# EAGLE design pcb1_12V_XL (EAGLE 9.6.2)
Assembly variants: ECU Type I non terminated, b

## Sheet 1 of 11
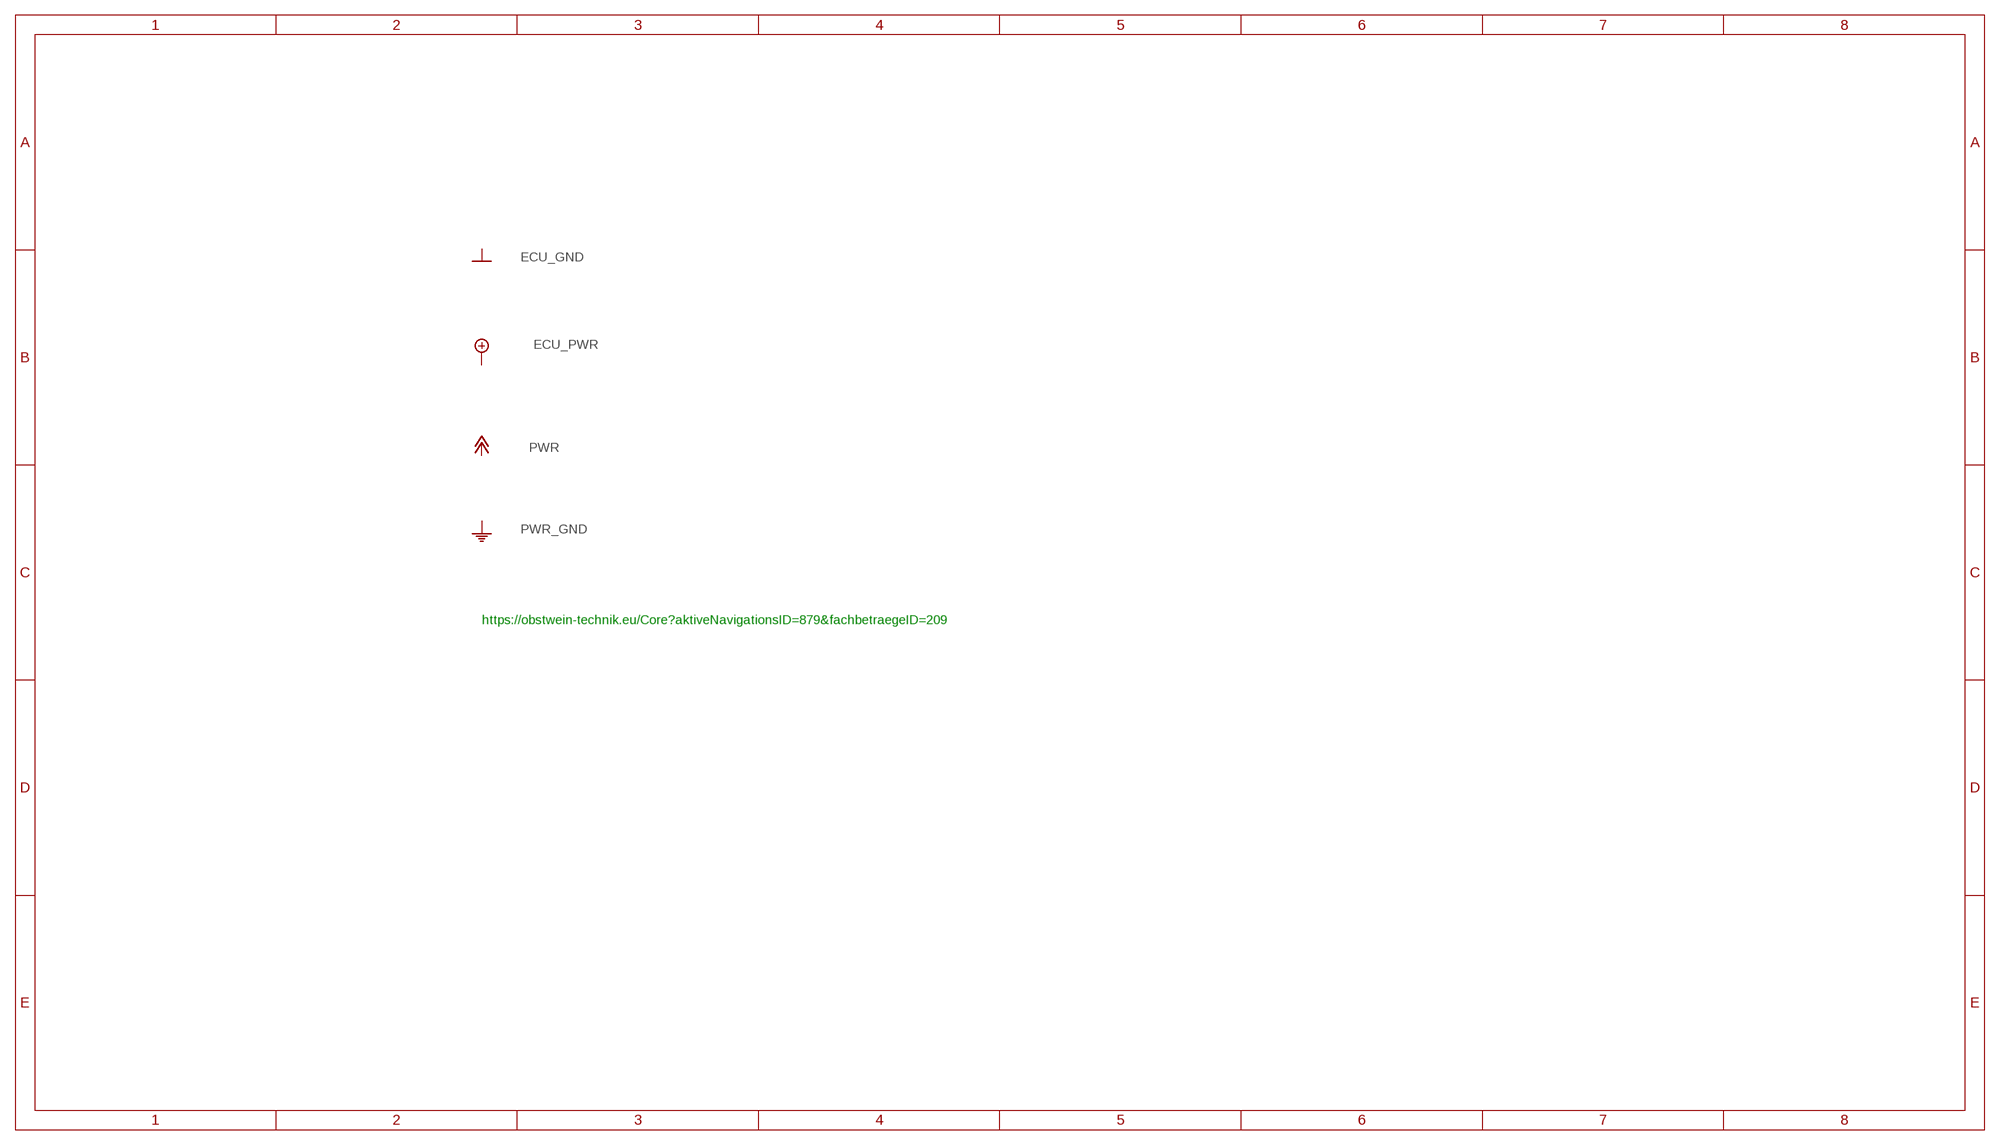
[diagram p0: schematic, sheet 1]

### Notes on the sheet
- https://obstwein-technik.eu/Core?aktiveNavigationsID=879&fachbetraegeID=209

## Sheet 2 of 11
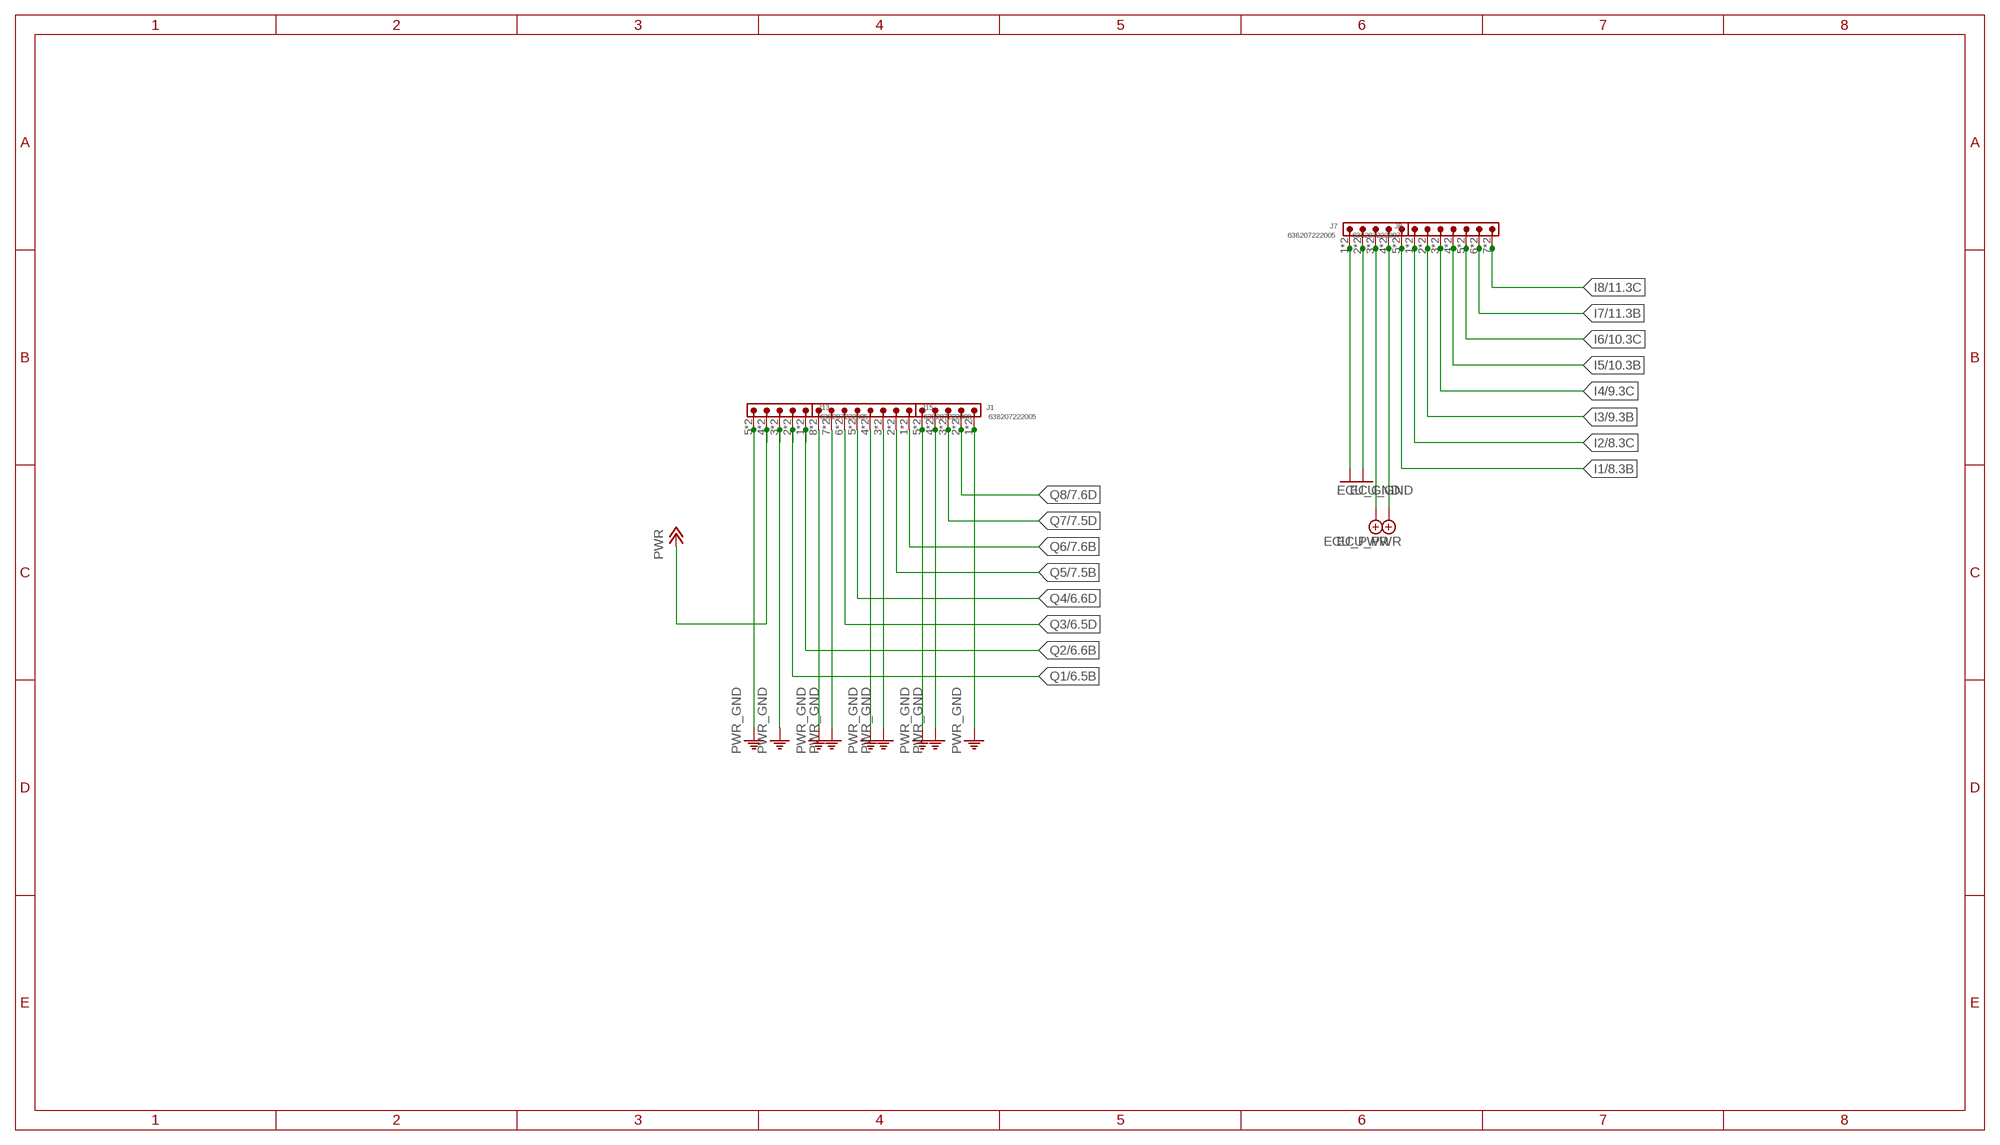
[diagram p1: schematic, sheet 2]

### Parts
J1  638207222005  638207222005  [638207222005]
J7  638207222005  638207222005  [638207222005]
J8  638207222007  638207222007  [638207222007]
J13  638207222005  638207222005  [638207222005]
J15  638207222008  638207222008  [638207222008]

### Nets
ECU_GND [GND]: J7.1 J7.A1 ; also sheet 3,4,5,6,7,8,9,10,11
ECU_PWR: J7.3 J7.A3 ; also sheet 3,6
I1: J7.5 J7.A5 ; also sheet 8
I2: J8.1 J8.A1 ; also sheet 8
I3: J8.2 J8.A2 ; also sheet 9
I4: J8.3 J8.A3 ; also sheet 9
I5: J8.4 J8.A4 ; also sheet 10
I6: J8.5 J8.A5 ; also sheet 10
I7: J8.6 J8.A6 ; also sheet 11
I8: J8.7 J8.A7 ; also sheet 11
N$7: J7.4 J7.A4 ; supply symbol labelled ECU_PWR
N$16 [GND]: J7.2 J7.A2 ; supply symbol labelled ECU_GND
N$20: J13.5 J13.A5 ; supply symbol labelled PWR_GND
PWR: J13.4 J13.A4 ; also sheet 6,7
PWR_GND: J1.1 J1.4 J1.5 J1.A1 J1.A4 J1.A5 J13.3 J13.A3 J15.3 J15.4 J15.7 J15.8 J15.A3 J15.A4 J15.A7 J15.A8 ; also sheet 6,7
Q1: J13.2 J13.A2 ; also sheet 6
Q2: J13.1 J13.A1 ; also sheet 6
Q3: J15.6 J15.A6 ; also sheet 6
Q4: J15.5 J15.A5 ; also sheet 6
Q5: J15.2 J15.A2 ; also sheet 7
Q6: J15.1 J15.A1 ; also sheet 7
Q7: J1.3 J1.A3 ; also sheet 7
Q8: J1.2 J1.A2 ; also sheet 7

## Sheet 3 of 11
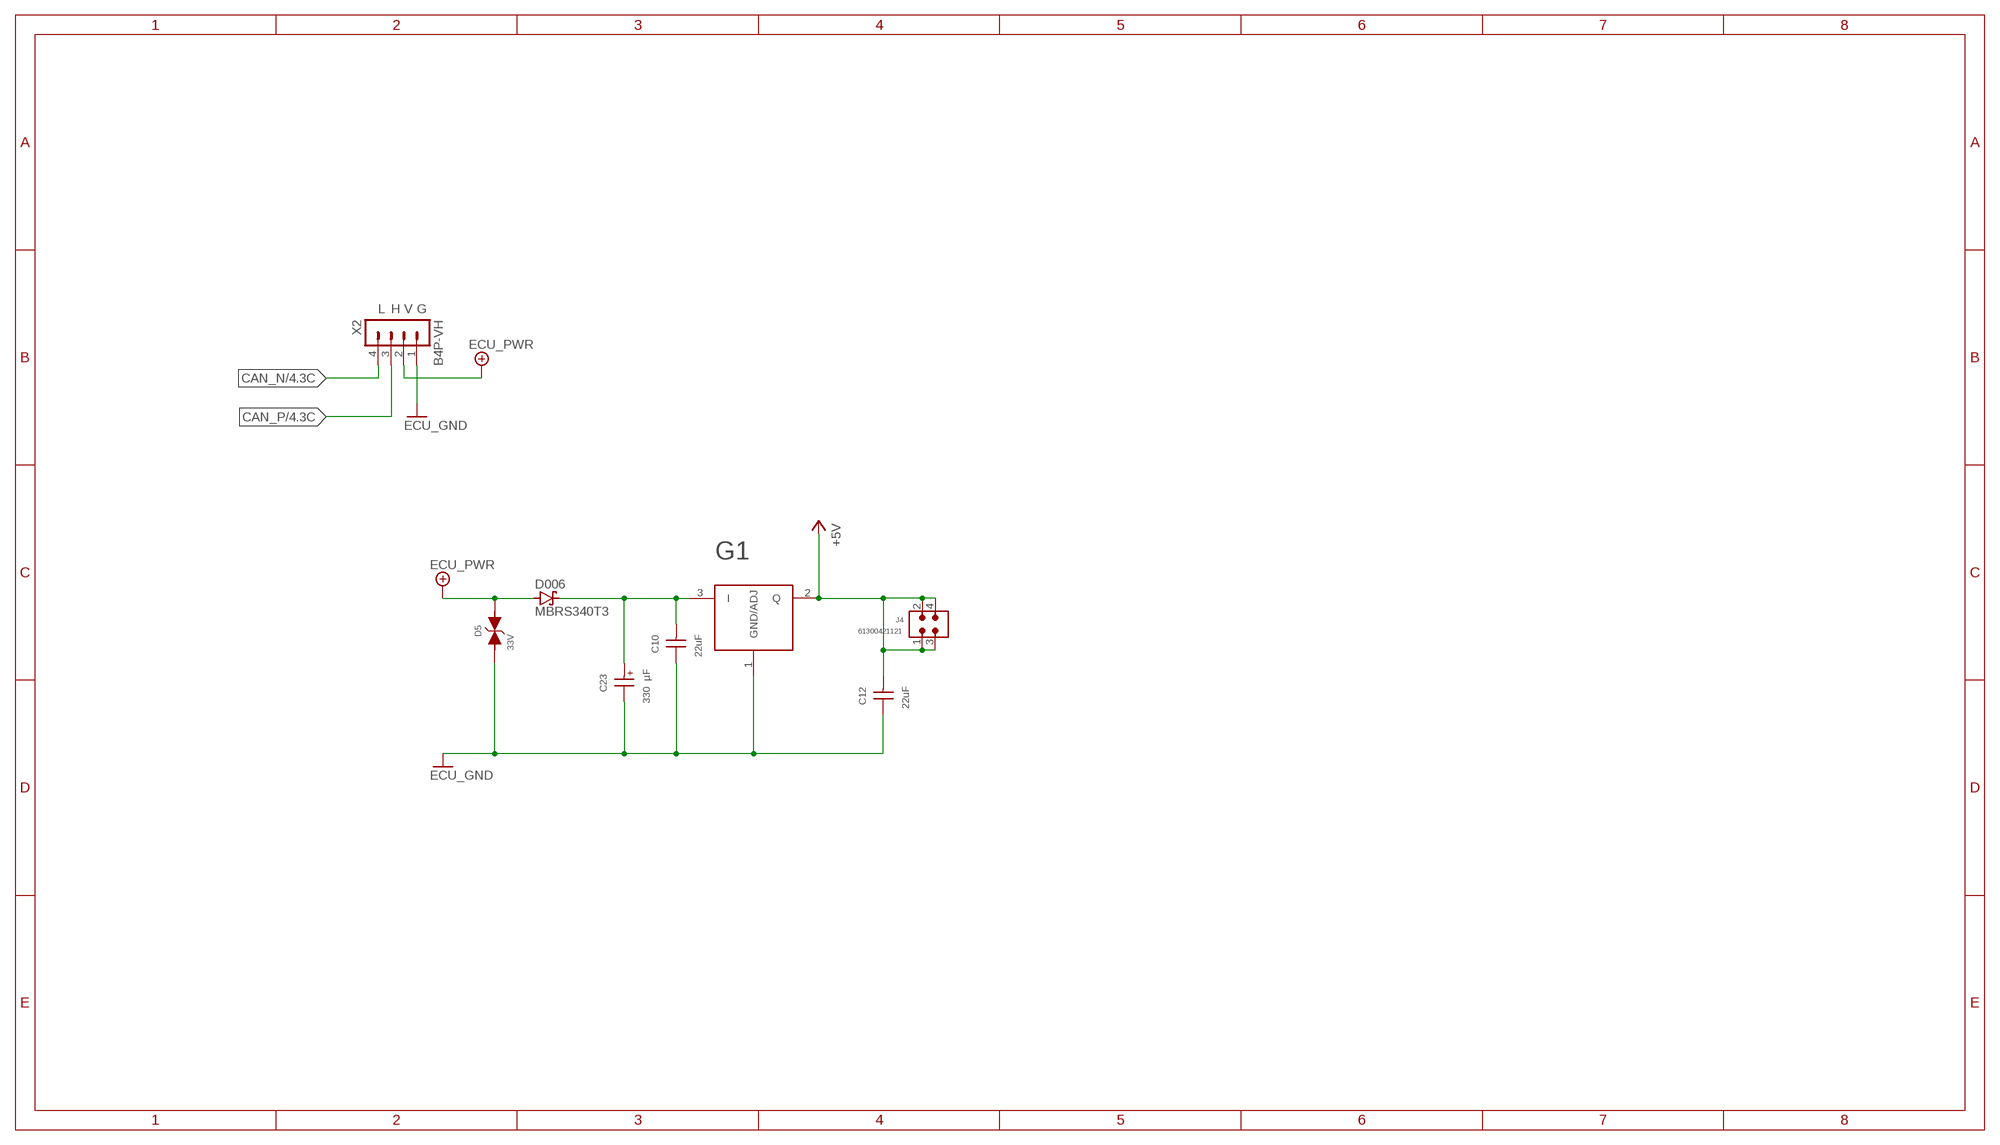
[diagram p2: schematic, sheet 3]

### Parts
C10  22uF  WCAP-CSGP_1210_H2.5_885012109014_25V(DC)  [WCAP-CSGP_1210_H2.5]
C12  22uF  WCAP-CSGP_0805_H1.25_885012107011_10V(DC)  [WCAP-CSGP_0805_H1.25_R]
C23  330 µF  WCAP-ASLI_12.5X14_865080662019  [WCAP-ASLI_12.5X14(DXL)]
D5  33V  WE-TVSP_DO-214AB_3000W_BI_824551331  [WE-TVSP_DO-214AB_BIDIRECTIONAL]
D006  MBRS340T3  [SMC]
G1  IFX27001TF_V50  [INF-PG-TO252-3-11_N]
J4  61300421121  6130XX21121_61300421121  [61300421121]
X2  B4P-VH  [B4P-VH]

### Nets
+5V: C12.2 G1.2(Q) J4.1 J4.2 J4.3 J4.4 ; also sheet 4,5
CAN_N: X2.4 ; also sheet 4
CAN_P: X2.3 ; also sheet 4
ECU_GND [GND]: C10.1 C12.1 C23.2(-) D5.1 G1.1(GND/ADJ) X2.1 ; also sheet 2,4,5,6,7,8,9,10,11
ECU_PWR: D5.2 D006.A X2.2 ; also sheet 2,6
N$3: C10.2 C23.1(+) D006.C G1.3(I)

### Notes on the sheet
- L | H | V | G

## Sheet 4 of 11
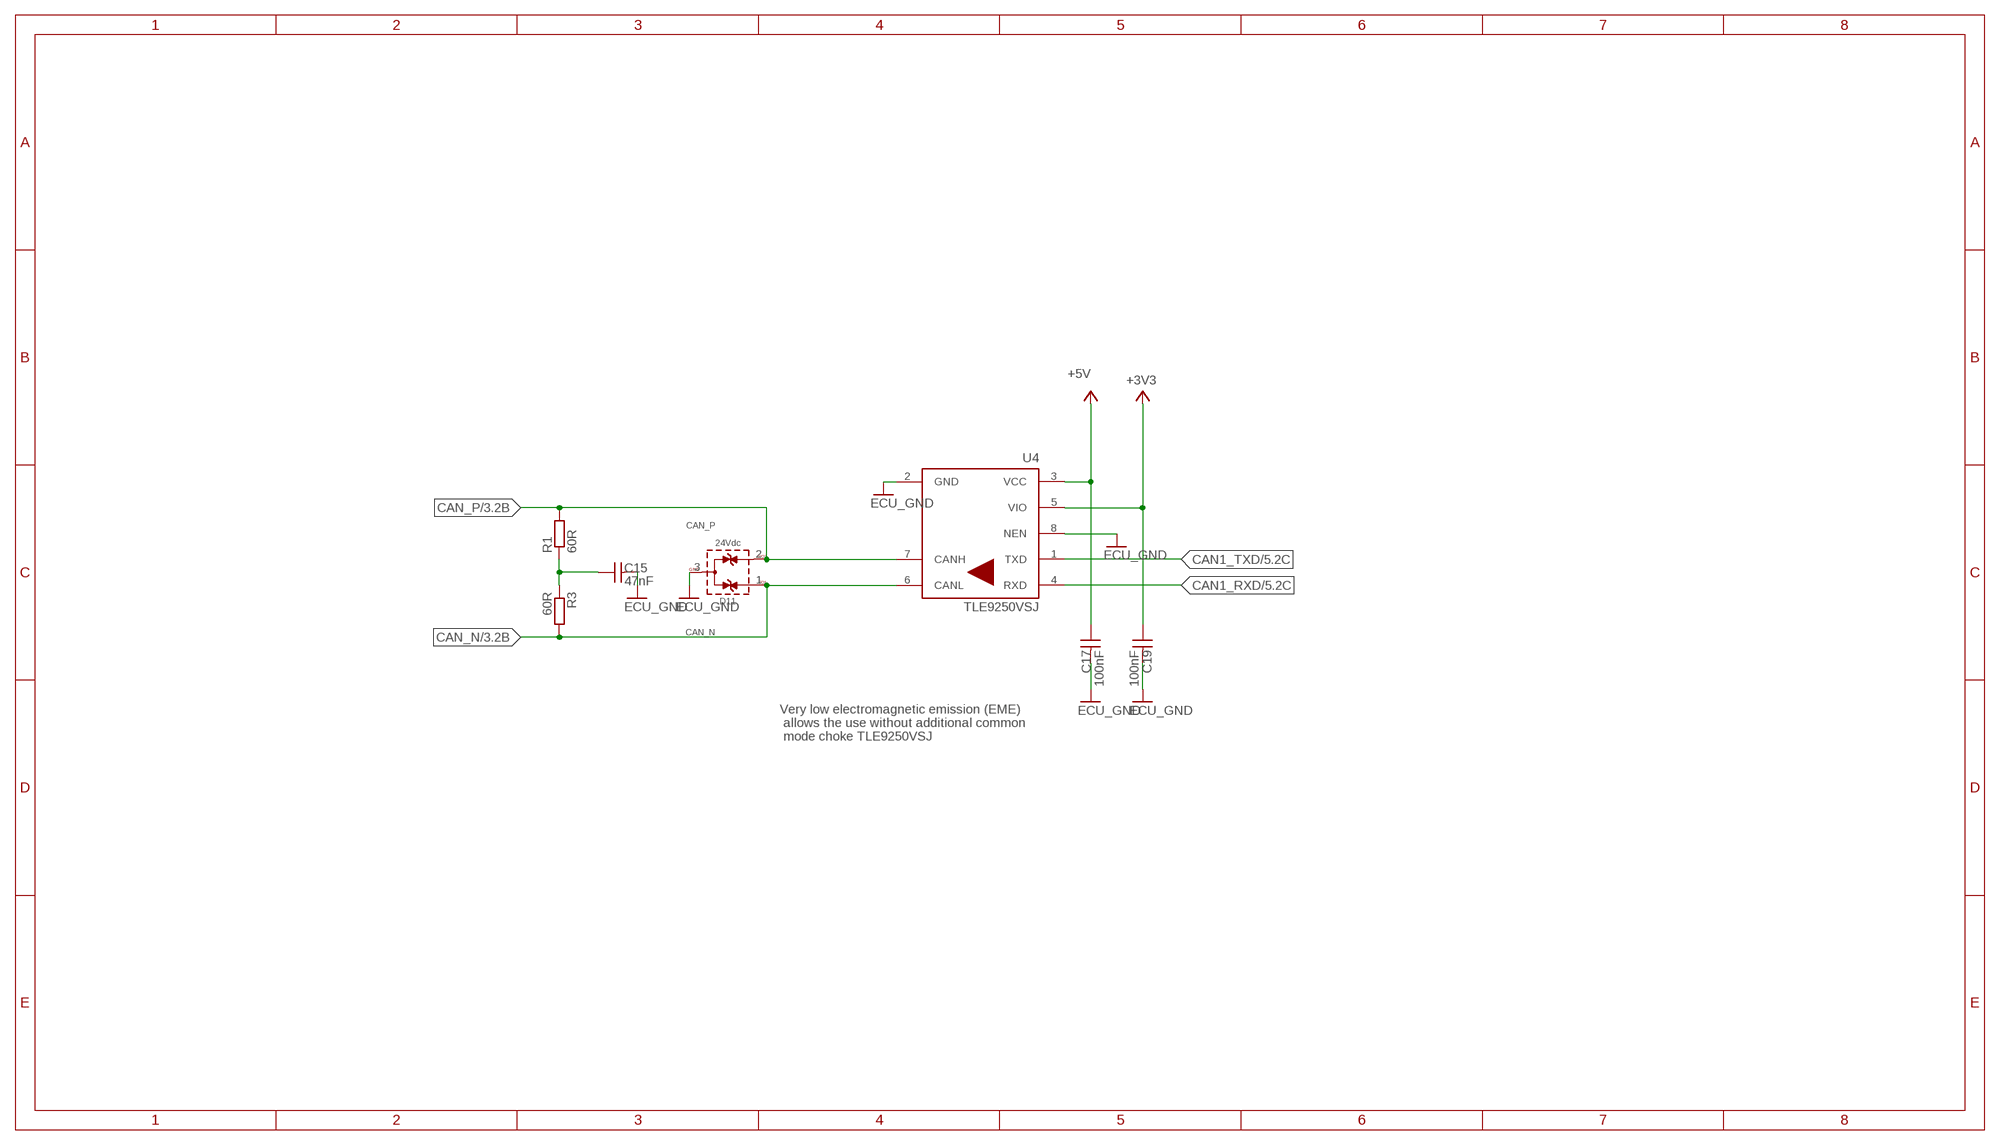
[diagram p3: schematic, sheet 4]

### Parts
C15  47nF  WCAP-CSGP_0805_H0.8_885012207096_50V(DC)_R  [WCAP-CSGP_0805_H0.8_R]
C17  100nF  WCAP-CSGP_0805_H0.8_885012207098_50V(DC)_R  [WCAP-CSGP_0805_H0.8_R]
C19  100nF  WCAP-CSGP_0805_H0.8_885012207098_50V(DC)_R  [WCAP-CSGP_0805_H0.8_R]
D11  24Vdc  WE-TVS_SOT23-3L_824094024  [WE-TVS_SOT23-3L]
R1  60R  R-EU_R0805  [R0805]
R3  60R  R-EU_R0805  [R0805]
U4  TLE9250VSJ  [SOIC127P602X173-8N-V]

### Nets
+3V3: C19.1 U4.5(VIO) ; also sheet 5,8,9,10,11
+5V: C17.1 U4.3(VCC) ; also sheet 3,5
CAN1_RXD: U4.4(RXD) ; also sheet 5
CAN1_TXD: U4.1(TXD) ; also sheet 5
CAN_N: D11.1(I/O1) R3.2 U4.6(CANL) ; also sheet 3
CAN_P: D11.2(I/O2) R1.2 U4.7(CANH) ; also sheet 3
ECU_GND [GND]: C15.2 C17.2 C19.2 D11.3(GND) U4.2(GND) U4.8(NEN) ; also sheet 2,3,5,6,7,8,9,10,11
N$17: C15.1 R1.1 R3.1

### Notes on the sheet
- Very low electromagnetic emission (EME)
   allows the use without additional common
   mode choke TLE9250VSJ

## Sheet 5 of 11
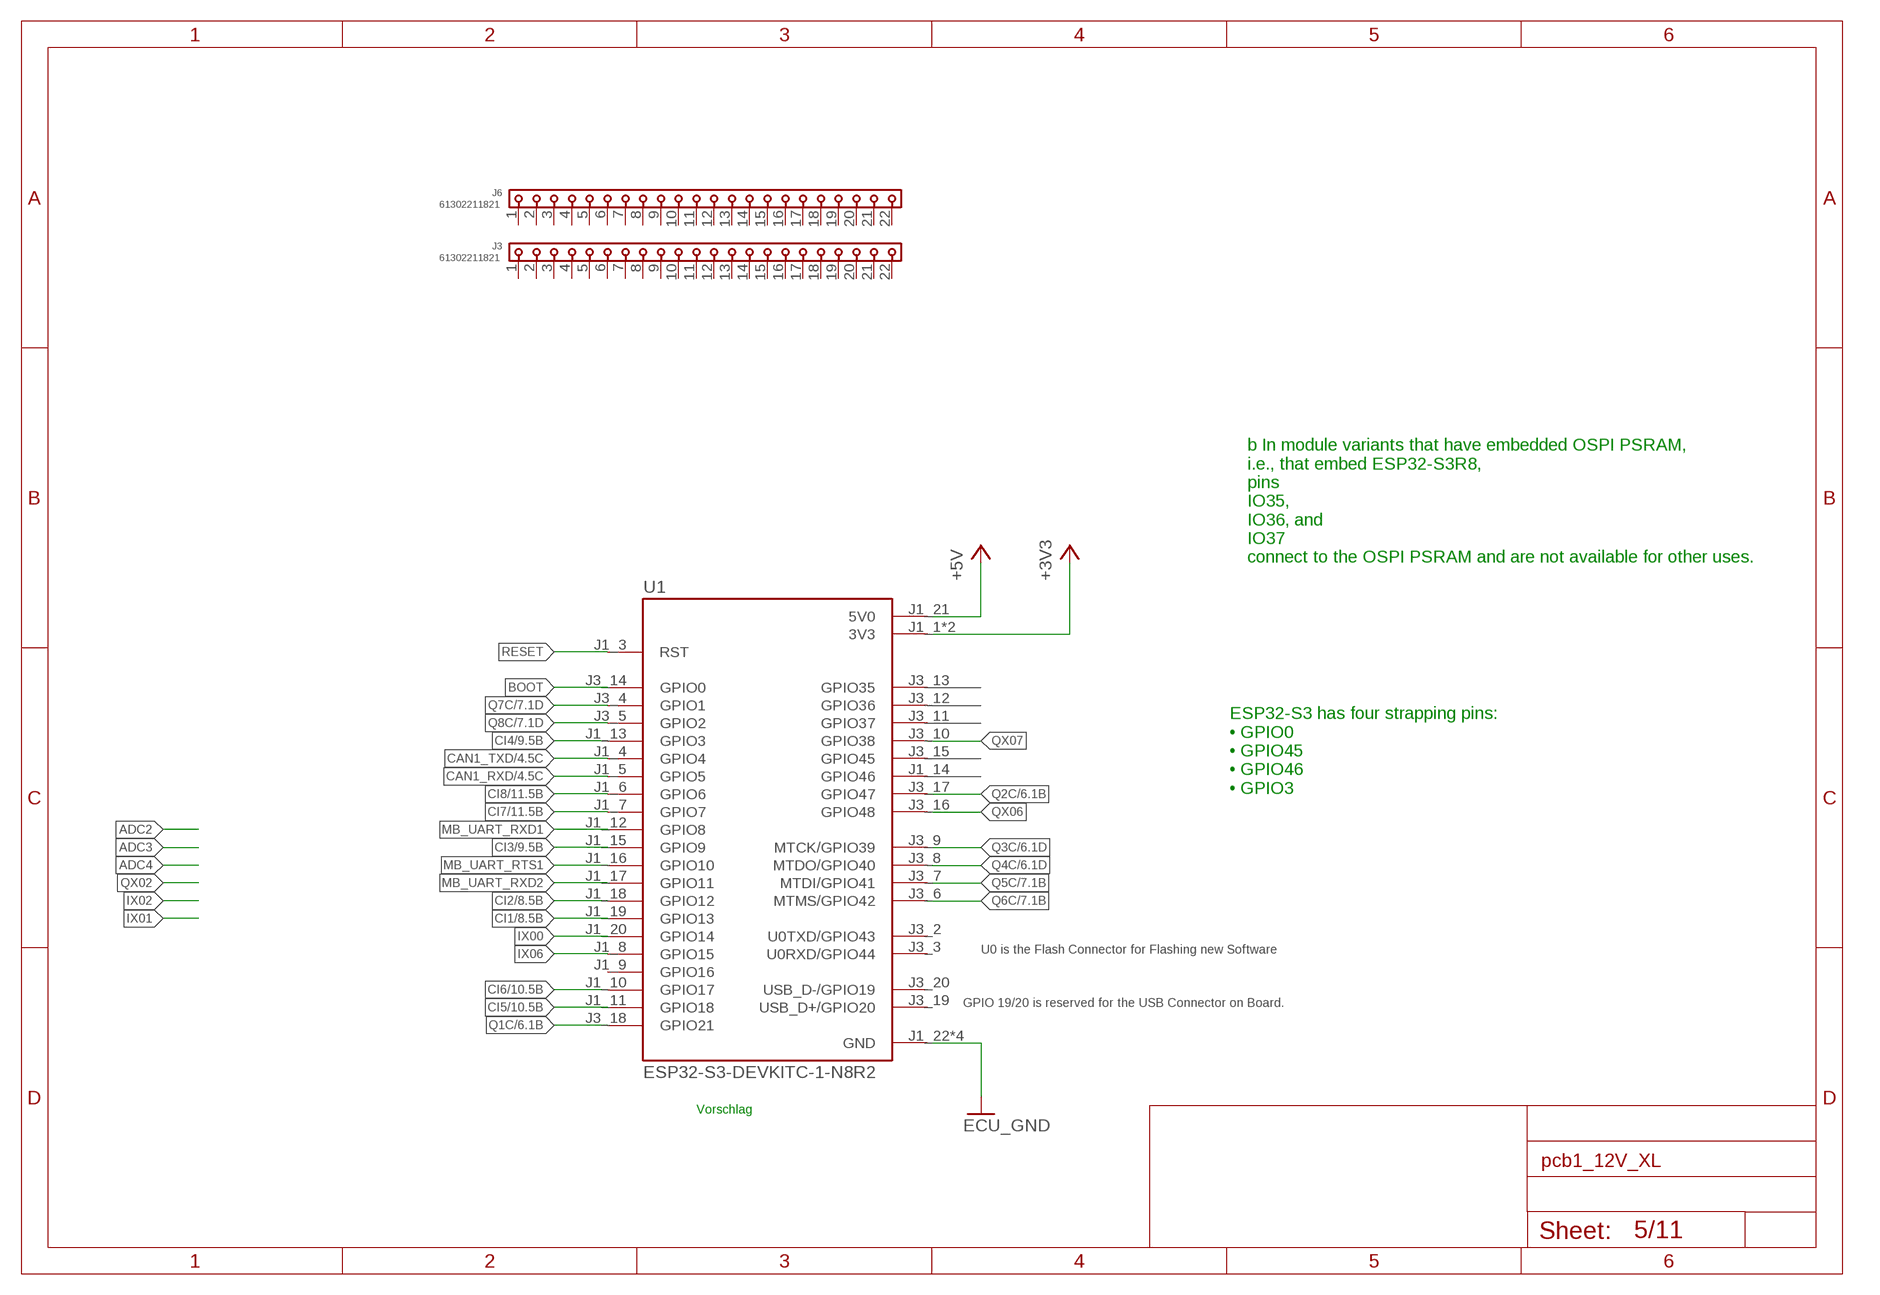
[diagram p4: schematic, sheet 5]

### Parts
J3  61302211821  6130XX11821_61302211821  [61302211821]
J6  61302211821  6130XX11821_61302211821  [61302211821]
U1  ESP32-S3-DEVKITC-1-N8R2  [XCVR_ESP32-S3-DEVKITC-1-N8R2]

### Nets
+3V3: U1.J1_1(3V3) U1.J1_2(3V3) ; also sheet 4,8,9,10,11
+5V: U1.J1_21(5V0) ; also sheet 3,4
BOOT: U1.J3_14(GPIO0)
CAN1_RXD: U1.J1_5(GPIO5) ; also sheet 4
CAN1_TXD: U1.J1_4(GPIO4) ; also sheet 4
CI1: U1.J1_19(GPIO13) ; also sheet 8
CI2: U1.J1_18(GPIO12) ; also sheet 8
CI3: U1.J1_15(GPIO9) ; also sheet 9
CI4: U1.J1_13(GPIO3) ; also sheet 9
CI5: U1.J1_11(GPIO18) ; also sheet 10
CI6: U1.J1_10(GPIO17) ; also sheet 10
CI7: U1.J1_7(GPIO7) ; also sheet 11
CI8: U1.J1_6(GPIO6) ; also sheet 11
ECU_GND [GND]: U1.J1_22(GND) U1.J3_1(GND) U1.J3_21(GND) U1.J3_22(GND) ; also sheet 2,3,4,6,7,8,9,10,11
IX00: U1.J1_20(GPIO14)
IX06: U1.J1_8(GPIO15)
MB_UART_RTS1: U1.J1_16(GPIO10)
MB_UART_RXD1: U1.J1_12(GPIO8)
MB_UART_RXD2: U1.J1_17(GPIO11)
Q1C: U1.J3_18(GPIO21) ; also sheet 6
Q2C: U1.J3_17(GPIO47) ; also sheet 6
Q3C: U1.J3_9(MTCK/GPIO39) ; also sheet 6
Q4C: U1.J3_8(MTDO/GPIO40) ; also sheet 6
Q5C: U1.J3_7(MTDI/GPIO41) ; also sheet 7
Q6C: U1.J3_6(MTMS/GPIO42) ; also sheet 7
Q7C: U1.J3_4(GPIO1) ; also sheet 7
Q8C: U1.J3_5(GPIO2) ; also sheet 7
QX06: U1.J3_16(GPIO48)
QX07: U1.J3_10(GPIO38)
RESET: U1.J1_3(RST)
Unconnected: J3.1 J3.2 J3.3 J3.4 J3.5 J3.6 J3.7 J3.8 J3.9 J3.10 J3.11 J3.12 J3.13 J3.14 J3.15 J3.16 J3.17 J3.18 J3.19 J3.20 J3.21 J3.22 J6.1 J6.2 J6.3 J6.4 J6.5 J6.6 J6.7 J6.8 J6.9 J6.10 J6.11 J6.12 J6.13 J6.14 J6.15 J6.16 J6.17 J6.18 J6.19 J6.20 J6.21 J6.22 U1.J1_9(GPIO16) U1.J1_14(GPIO46) U1.J3_2(U0TXD/GPIO43) U1.J3_3(U0RXD/GPIO44) U1.J3_11(GPIO37) U1.J3_12(GPIO36) U1.J3_13(GPIO35) U1.J3_15(GPIO45) U1.J3_19(USB_D+/GPIO20) U1.J3_20(USB_D-/GPIO19)

### Notes on the sheet
- b In module variants that have embedded OSPI PSRAM, 
  i.e., that embed ESP32-S3R8, 
  pins 
  IO35, 
  IO36, and 
  IO37 
  connect to the OSPI PSRAM and are not available for other uses.
- ESP32-S3 has four strapping pins: 
  • GPIO0 
  • GPIO45 
  • GPIO46 
  • GPIO3
- U0 is the Flash Connector for Flashing new Software
- GPIO 19/20 is reserved for the USB Connector on Board.
- Vorschlag

## Sheet 6 of 11
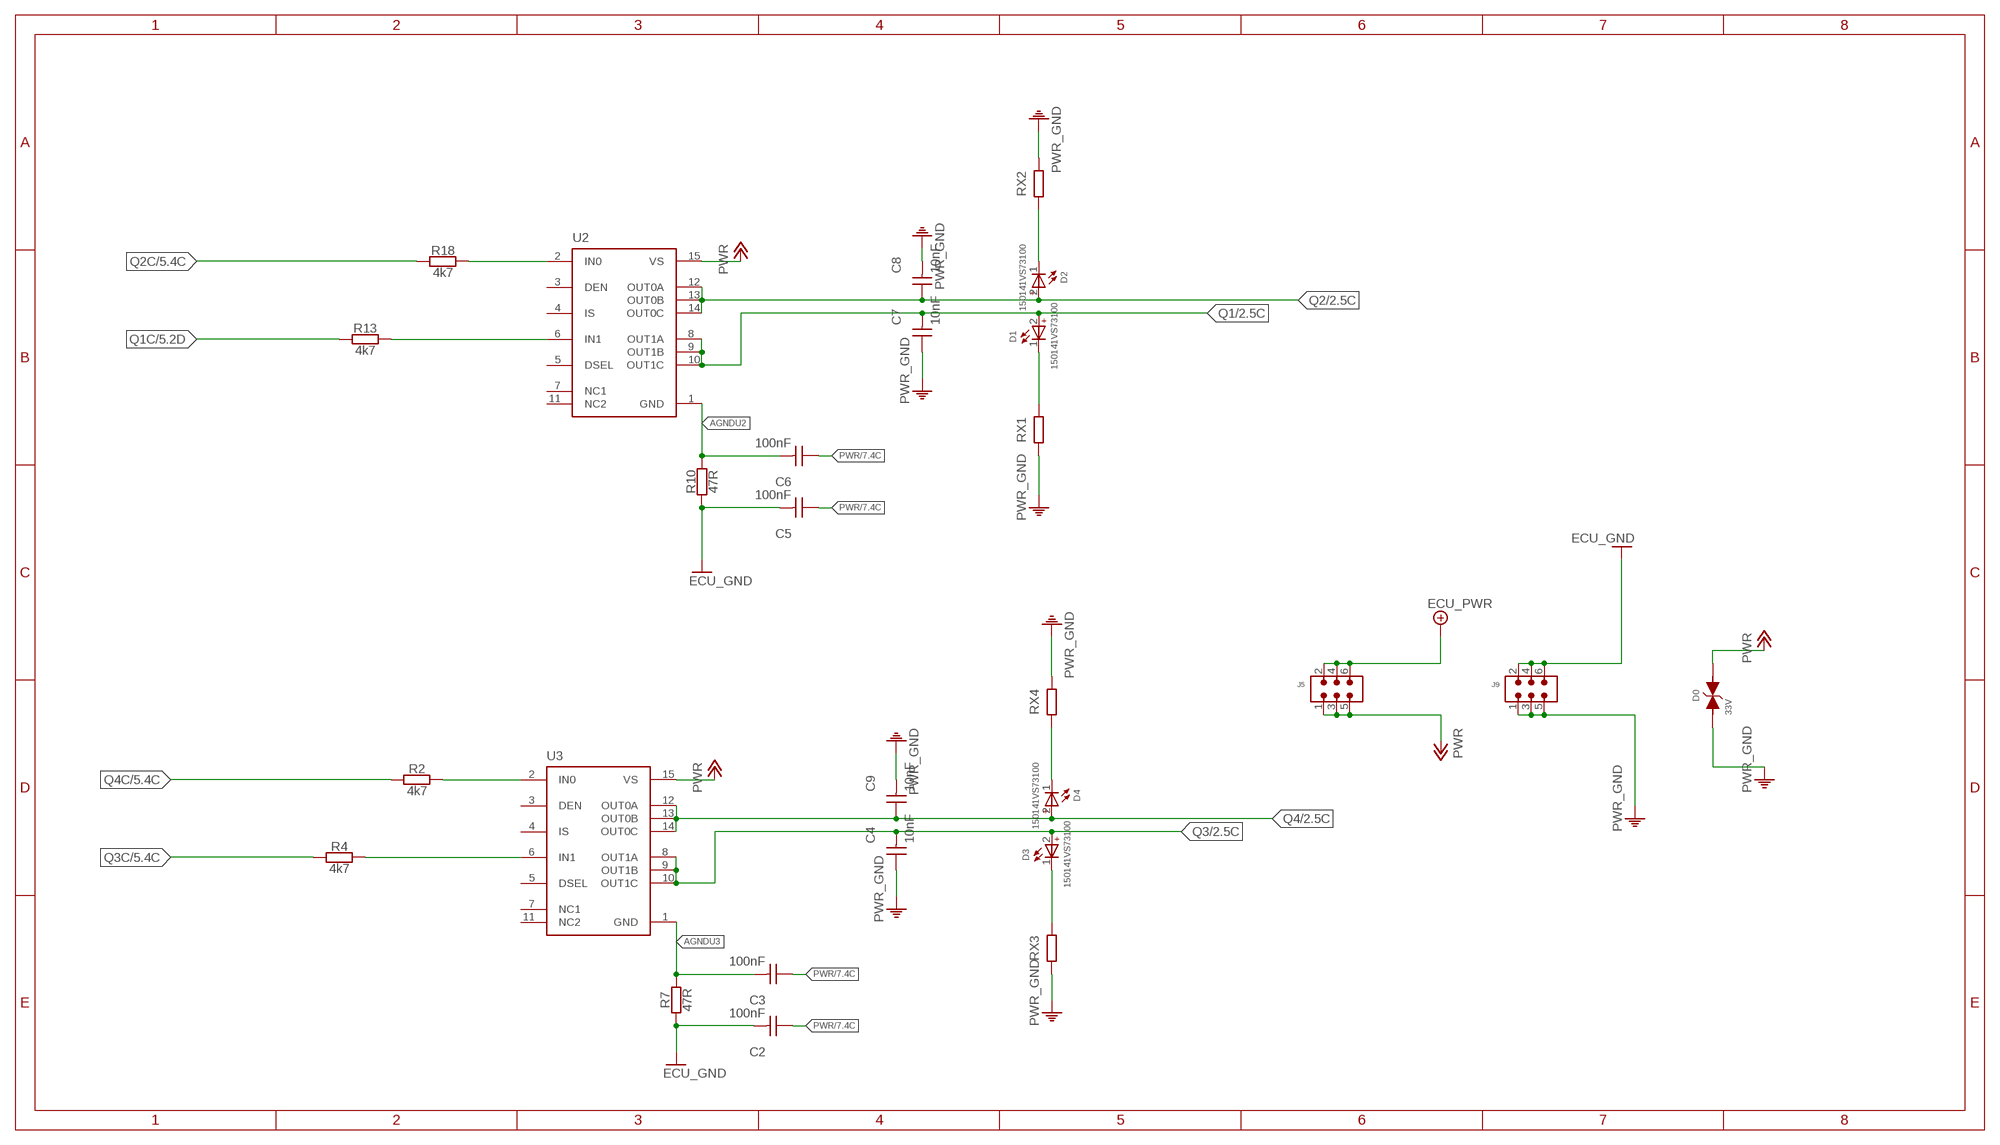
[diagram p5: schematic, sheet 6]

### Parts
C2  100nF  WCAP-CSGP_0805_H0.8_885012207098_50V(DC)_R  [WCAP-CSGP_0805_H0.8_R]
C3  100nF  WCAP-CSGP_0805_H0.8_885012207098_50V(DC)_R  [WCAP-CSGP_0805_H0.8_R]
C4  10nF  WCAP-CSGP_0805_H0.8_885012207092_50V(DC)_R  [WCAP-CSGP_0805_H0.8_R]
C5  100nF  WCAP-CSGP_0805_H0.8_885012207098_50V(DC)_R  [WCAP-CSGP_0805_H0.8_R]
C6  100nF  WCAP-CSGP_0805_H0.8_885012207098_50V(DC)_R  [WCAP-CSGP_0805_H0.8_R]
C7  10nF  WCAP-CSGP_0805_H0.8_885012207092_50V(DC)_R  [WCAP-CSGP_0805_H0.8_R]
C8  10nF  WCAP-CSGP_0805_H0.8_885012207092_50V(DC)_R  [WCAP-CSGP_0805_H0.8_R]
C9  10nF  WCAP-CSGP_0805_H0.8_885012207092_50V(DC)_R  [WCAP-CSGP_0805_H0.8_R]
D0  33V  WE-TVSP_DO-214AB_3000W_BI_824551331  [WE-TVSP_DO-214AB_BIDIRECTIONAL]
D1  150141VS73100  WL-SMTW_3528_150141VS73100  [WL-SMTW_3528]
D2  150141VS73100  WL-SMTW_3528_150141VS73100  [WL-SMTW_3528]
D3  150141VS73100  WL-SMTW_3528_150141VS73100  [WL-SMTW_3528]
D4  150141VS73100  WL-SMTW_3528_150141VS73100  [WL-SMTW_3528]
J5  6130XX21121_61300621121  [61300621121]
J9  6130XX21121_61300621121  [61300621121]
R2  4k7  R-EU_R0805  [R0805]
R4  4k7  R-EU_R0805  [R0805]
R7  47R  R-EU_R0805  [R0805]
R10  47R  R-EU_R0805  [R0805]
R13  4k7  R-EU_R0805  [R0805]
R18  4k7  R-EU_R0805  [R0805]
RX1  470Ohm  R-EU_R1206  [R1206]
RX2  470Ohm  R-EU_R1206  [R1206]
RX3  470Ohm  R-EU_R1206  [R1206]
RX4  470Ohm  R-EU_R1206  [R1206]
U2  BTS7030-2EPA  [SOP65P600X115-15N-V]
U3  BTS7030-2EPA  [SOP65P600X115-15N-V]

### Nets
AGNDU2: C6.2 R10.2 U2.1(GND)
AGNDU3: C3.2 R7.2 U3.1(GND)
ECU_GND [GND]: C2.2 C5.2 J9.2 J9.4 J9.6 R7.1 R10.1 ; also sheet 2,3,4,5,7,8,9,10,11
ECU_PWR: J5.2 J5.4 J5.6 ; also sheet 2,3
N$1 [GND]: D4.1(-) RX4.1
N$2: R2.2 U3.2(IN0)
N$4: R4.2 U3.6(IN1)
N$6 [GND]: D2.1(-) RX2.1
N$8 [GND]: D1.1(-) RX1.2
N$9 [GND]: D3.1(-) RX3.2
N$10: R18.2 U2.2(IN0)
N$14: R13.2 U2.6(IN1)
PWR: C2.1 C3.1 C5.1 C6.1 D0.2 J5.1 J5.3 J5.5 U2.15(VS) U3.15(VS) ; also sheet 2,7
PWR_GND: C4.1 C7.1 C8.2 C9.2 D0.1 J9.1 J9.3 J9.5 RX1.1 RX2.2 RX3.1 RX4.2 ; also sheet 2,7
Q1: C7.2 D1.2(+) U2.8(OUT1A) U2.9(OUT1B) U2.10(OUT1C) ; also sheet 2
Q1C: R13.1 ; also sheet 5
Q2: C8.1 D2.2(+) U2.12(OUT0A) U2.13(OUT0B) U2.14(OUT0C) ; also sheet 2
Q2C: R18.1 ; also sheet 5
Q3: C4.2 D3.2(+) U3.8(OUT1A) U3.9(OUT1B) U3.10(OUT1C) ; also sheet 2
Q3C: R4.1 ; also sheet 5
Q4: C9.1 D4.2(+) U3.12(OUT0A) U3.13(OUT0B) U3.14(OUT0C) ; also sheet 2
Q4C: R2.1 ; also sheet 5
Unconnected: U2.3(DEN) U2.4(IS) U2.5(DSEL) U2.7(NC1) U2.11(NC2) U3.3(DEN) U3.4(IS) U3.5(DSEL) U3.7(NC1) U3.11(NC2)

## Sheet 7 of 11
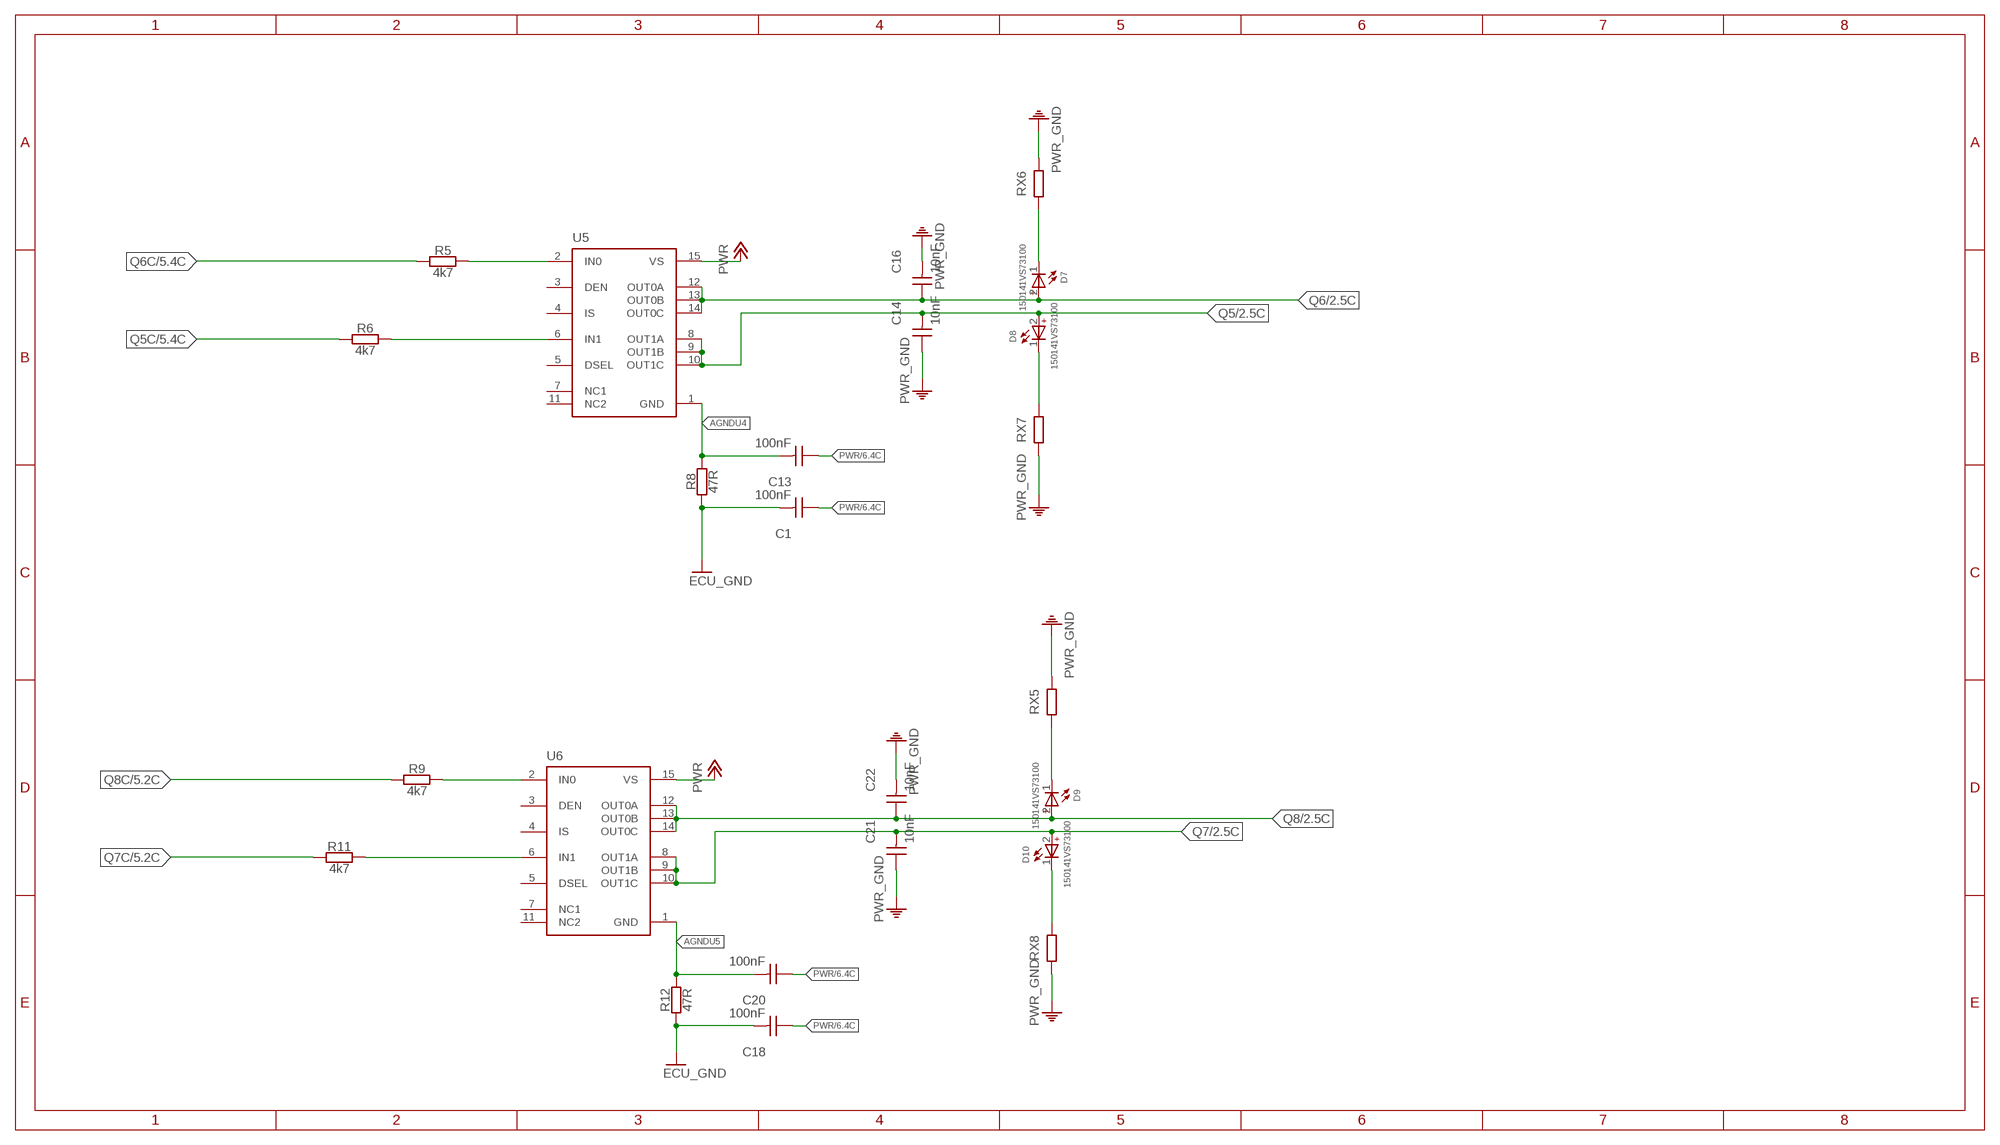
[diagram p6: schematic, sheet 7]

### Parts
C1  100nF  WCAP-CSGP_0805_H0.8_885012207098_50V(DC)_R  [WCAP-CSGP_0805_H0.8_R]
C13  100nF  WCAP-CSGP_0805_H0.8_885012207098_50V(DC)_R  [WCAP-CSGP_0805_H0.8_R]
C14  10nF  WCAP-CSGP_0805_H0.8_885012207092_50V(DC)_R  [WCAP-CSGP_0805_H0.8_R]
C16  10nF  WCAP-CSGP_0805_H0.8_885012207092_50V(DC)_R  [WCAP-CSGP_0805_H0.8_R]
C18  100nF  WCAP-CSGP_0805_H0.8_885012207098_50V(DC)_R  [WCAP-CSGP_0805_H0.8_R]
C20  100nF  WCAP-CSGP_0805_H0.8_885012207098_50V(DC)_R  [WCAP-CSGP_0805_H0.8_R]
C21  10nF  WCAP-CSGP_0805_H0.8_885012207092_50V(DC)_R  [WCAP-CSGP_0805_H0.8_R]
C22  10nF  WCAP-CSGP_0805_H0.8_885012207092_50V(DC)_R  [WCAP-CSGP_0805_H0.8_R]
D7  150141VS73100  WL-SMTW_3528_150141VS73100  [WL-SMTW_3528]
D8  150141VS73100  WL-SMTW_3528_150141VS73100  [WL-SMTW_3528]
D9  150141VS73100  WL-SMTW_3528_150141VS73100  [WL-SMTW_3528]
D10  150141VS73100  WL-SMTW_3528_150141VS73100  [WL-SMTW_3528]
R5  4k7  R-EU_R0805  [R0805]
R6  4k7  R-EU_R0805  [R0805]
R8  47R  R-EU_R0805  [R0805]
R9  4k7  R-EU_R0805  [R0805]
R11  4k7  R-EU_R0805  [R0805]
R12  47R  R-EU_R0805  [R0805]
RX5  470Ohm  R-EU_R1206  [R1206]
RX6  470Ohm  R-EU_R1206  [R1206]
RX7  470Ohm  R-EU_R1206  [R1206]
RX8  470Ohm  R-EU_R1206  [R1206]
U5  BTS7030-2EPA  [SOP65P600X115-15N-V]
U6  BTS7030-2EPA  [SOP65P600X115-15N-V]

### Nets
+6V [GND]: D7.1(-) RX6.1
AGNDU4: C13.2 R8.2 U5.1(GND)
AGNDU5: C20.2 R12.2 U6.1(GND)
ECU_GND [GND]: C1.2 C18.2 R8.1 R12.1 ; also sheet 2,3,4,5,6,8,9,10,11
N$5: R5.2 U5.2(IN0)
N$11: R6.2 U5.6(IN1)
N$12: R9.2 U6.2(IN0)
N$13: R11.2 U6.6(IN1)
N$15 [GND]: D9.1(-) RX5.1
N$18 [GND]: D8.1(-) RX7.2
N$19 [GND]: D10.1(-) RX8.2
PWR: C1.1 C13.1 C18.1 C20.1 U5.15(VS) U6.15(VS) ; also sheet 2,6
PWR_GND: C14.1 C16.2 C21.1 C22.2 RX5.2 RX6.2 RX7.1 RX8.1 ; also sheet 2,6
Q5: C14.2 D8.2(+) U5.8(OUT1A) U5.9(OUT1B) U5.10(OUT1C) ; also sheet 2
Q5C: R6.1 ; also sheet 5
Q6: C16.1 D7.2(+) U5.12(OUT0A) U5.13(OUT0B) U5.14(OUT0C) ; also sheet 2
Q6C: R5.1 ; also sheet 5
Q7: C21.2 D10.2(+) U6.8(OUT1A) U6.9(OUT1B) U6.10(OUT1C) ; also sheet 2
Q7C: R11.1 ; also sheet 5
Q8: C22.1 D9.2(+) U6.12(OUT0A) U6.13(OUT0B) U6.14(OUT0C) ; also sheet 2
Q8C: R9.1 ; also sheet 5
Unconnected: U5.3(DEN) U5.4(IS) U5.5(DSEL) U5.7(NC1) U5.11(NC2) U6.3(DEN) U6.4(IS) U6.5(DSEL) U6.7(NC1) U6.11(NC2)

## Sheet 8 of 11
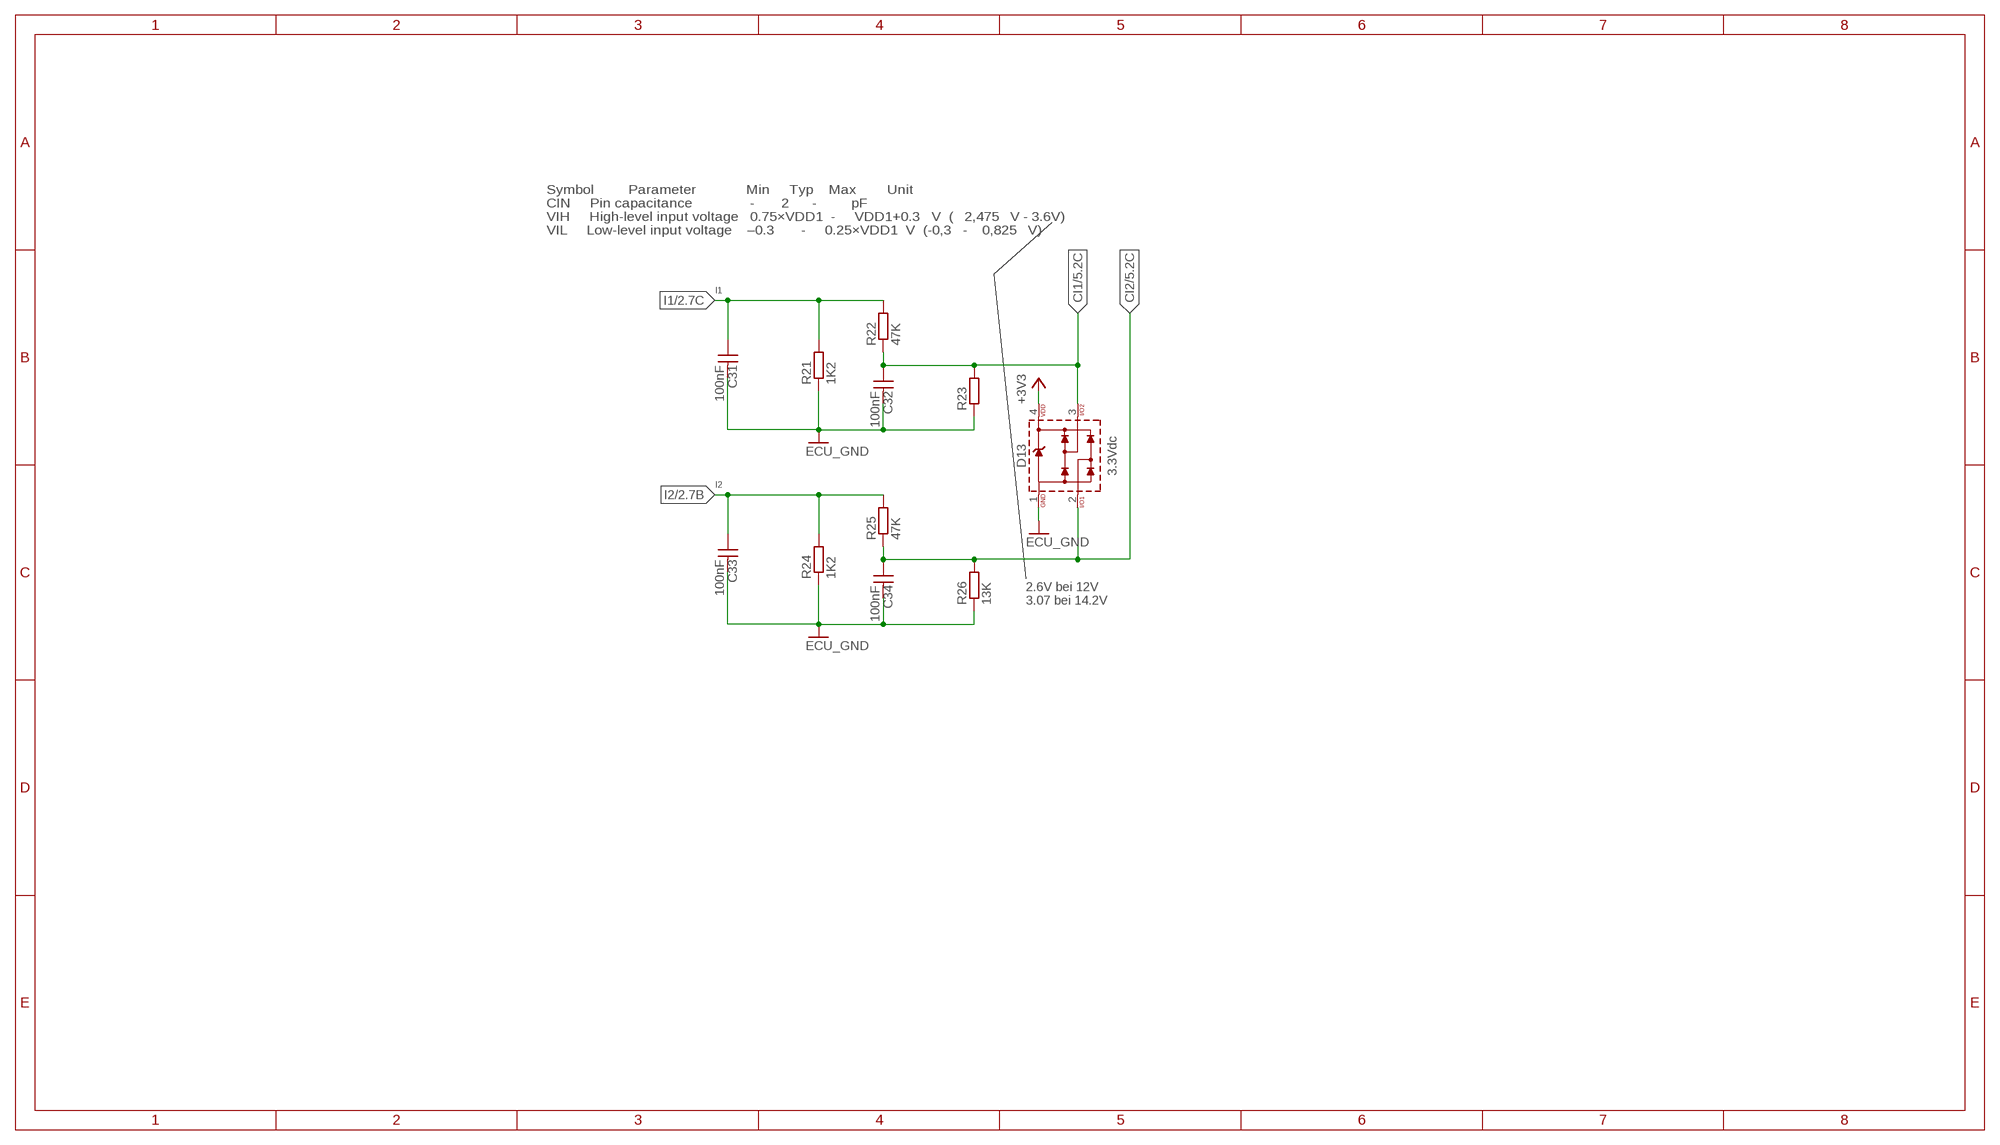
[diagram p7: schematic, sheet 8]

### Parts
C31  100nF  WCAP-CSGP_1206_H0.8_885012208087_50V(DC)  [WCAP-CSGP_1206_H0.8]
C32  100nF  WCAP-CSGP_1206_H0.8_885012208087_50V(DC)  [WCAP-CSGP_1206_H0.8]
C33  100nF  WCAP-CSGP_1206_H0.8_885012208087_50V(DC)  [WCAP-CSGP_1206_H0.8]
C34  100nF  WCAP-CSGP_1206_H0.8_885012208087_50V(DC)  [WCAP-CSGP_1206_H0.8]
D13  3.3Vdc  WE-TVS-HS_SOT143-4L_8240136  [WE-TVS_SOT143-4L]
R21  1K2  R-EU_R1206  [R1206]
R22  47K  R-EU_R1206  [R1206]
R23  13K  R-EU_R1206  [R1206]
R24  1K2  R-EU_R1206  [R1206]
R25  47K  R-EU_R1206  [R1206]
R26  13K  R-EU_R1206  [R1206]

### Nets
+3V3: D13.4(VDD) ; also sheet 4,5,9,10,11
CI1: C32.1 D13.3 R22.1 R23.2 ; also sheet 5
CI2: C34.1 D13.2 R25.1 R26.2 ; also sheet 5
ECU_GND [GND]: C31.2 C32.2 C33.2 C34.2 D13.1(GND) R21.1 R23.1 R24.1 R26.1 ; also sheet 2,3,4,5,6,7,9,10,11
I1: C31.1 R21.2 R22.2 ; also sheet 2
I2: C33.1 R24.2 R25.2 ; also sheet 2

### Notes on the sheet
- Symbol         Parameter             Min     Typ    Max        Unit
  CIN     Pin capacitance               -       2      -         pF
  VIH     High-level input voltage   0.75×VDD1  -     VDD1+0.3   V  (‭2,475‬V - 3.6V)
  VIL     Low-level input voltage    –0.3       -     0.25×VDD1  V  (-0,3   - ‭0,825‬V)
- 2.6V bei 12V
  3.07 bei 14.2V

## Sheet 9 of 11
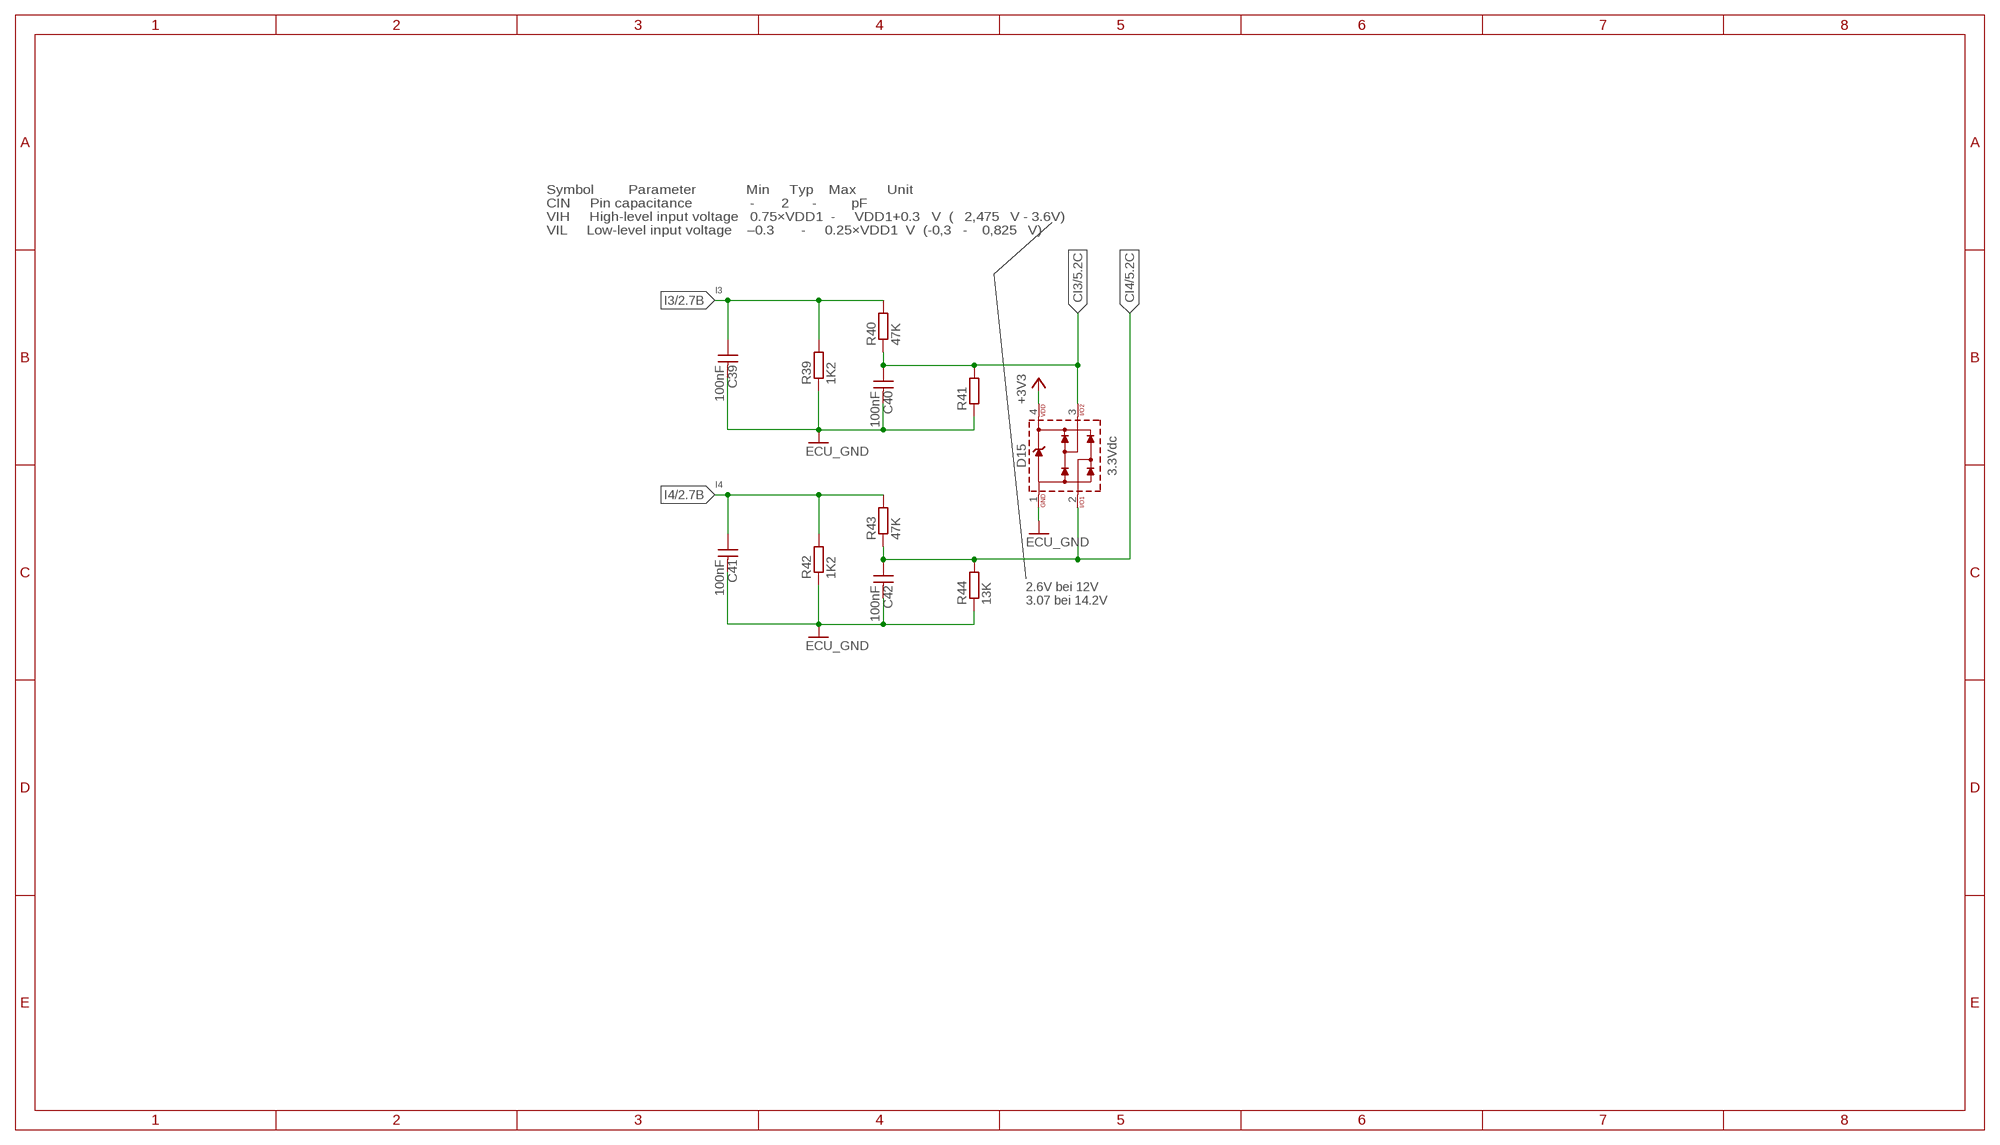
[diagram p8: schematic, sheet 9]

### Parts
C39  100nF  WCAP-CSGP_1206_H0.8_885012208087_50V(DC)  [WCAP-CSGP_1206_H0.8]
C40  100nF  WCAP-CSGP_1206_H0.8_885012208087_50V(DC)  [WCAP-CSGP_1206_H0.8]
C41  100nF  WCAP-CSGP_1206_H0.8_885012208087_50V(DC)  [WCAP-CSGP_1206_H0.8]
C42  100nF  WCAP-CSGP_1206_H0.8_885012208087_50V(DC)  [WCAP-CSGP_1206_H0.8]
D15  3.3Vdc  WE-TVS-HS_SOT143-4L_8240136  [WE-TVS_SOT143-4L]
R39  1K2  R-EU_R1206  [R1206]
R40  47K  R-EU_R1206  [R1206]
R41  13K  R-EU_R1206  [R1206]
R42  1K2  R-EU_R1206  [R1206]
R43  47K  R-EU_R1206  [R1206]
R44  13K  R-EU_R1206  [R1206]

### Nets
+3V3: D15.4(VDD) ; also sheet 4,5,8,10,11
CI3: C40.1 D15.3 R40.1 R41.2 ; also sheet 5
CI4: C42.1 D15.2 R43.1 R44.2 ; also sheet 5
ECU_GND [GND]: C39.2 C40.2 C41.2 C42.2 D15.1(GND) R39.1 R41.1 R42.1 R44.1 ; also sheet 2,3,4,5,6,7,8,10,11
I3: C39.1 R39.2 R40.2 ; also sheet 2
I4: C41.1 R42.2 R43.2 ; also sheet 2

### Notes on the sheet
- Symbol         Parameter             Min     Typ    Max        Unit
  CIN     Pin capacitance               -       2      -         pF
  VIH     High-level input voltage   0.75×VDD1  -     VDD1+0.3   V  (‭2,475‬V - 3.6V)
  VIL     Low-level input voltage    –0.3       -     0.25×VDD1  V  (-0,3   - ‭0,825‬V)
- 2.6V bei 12V
  3.07 bei 14.2V

## Sheet 10 of 11
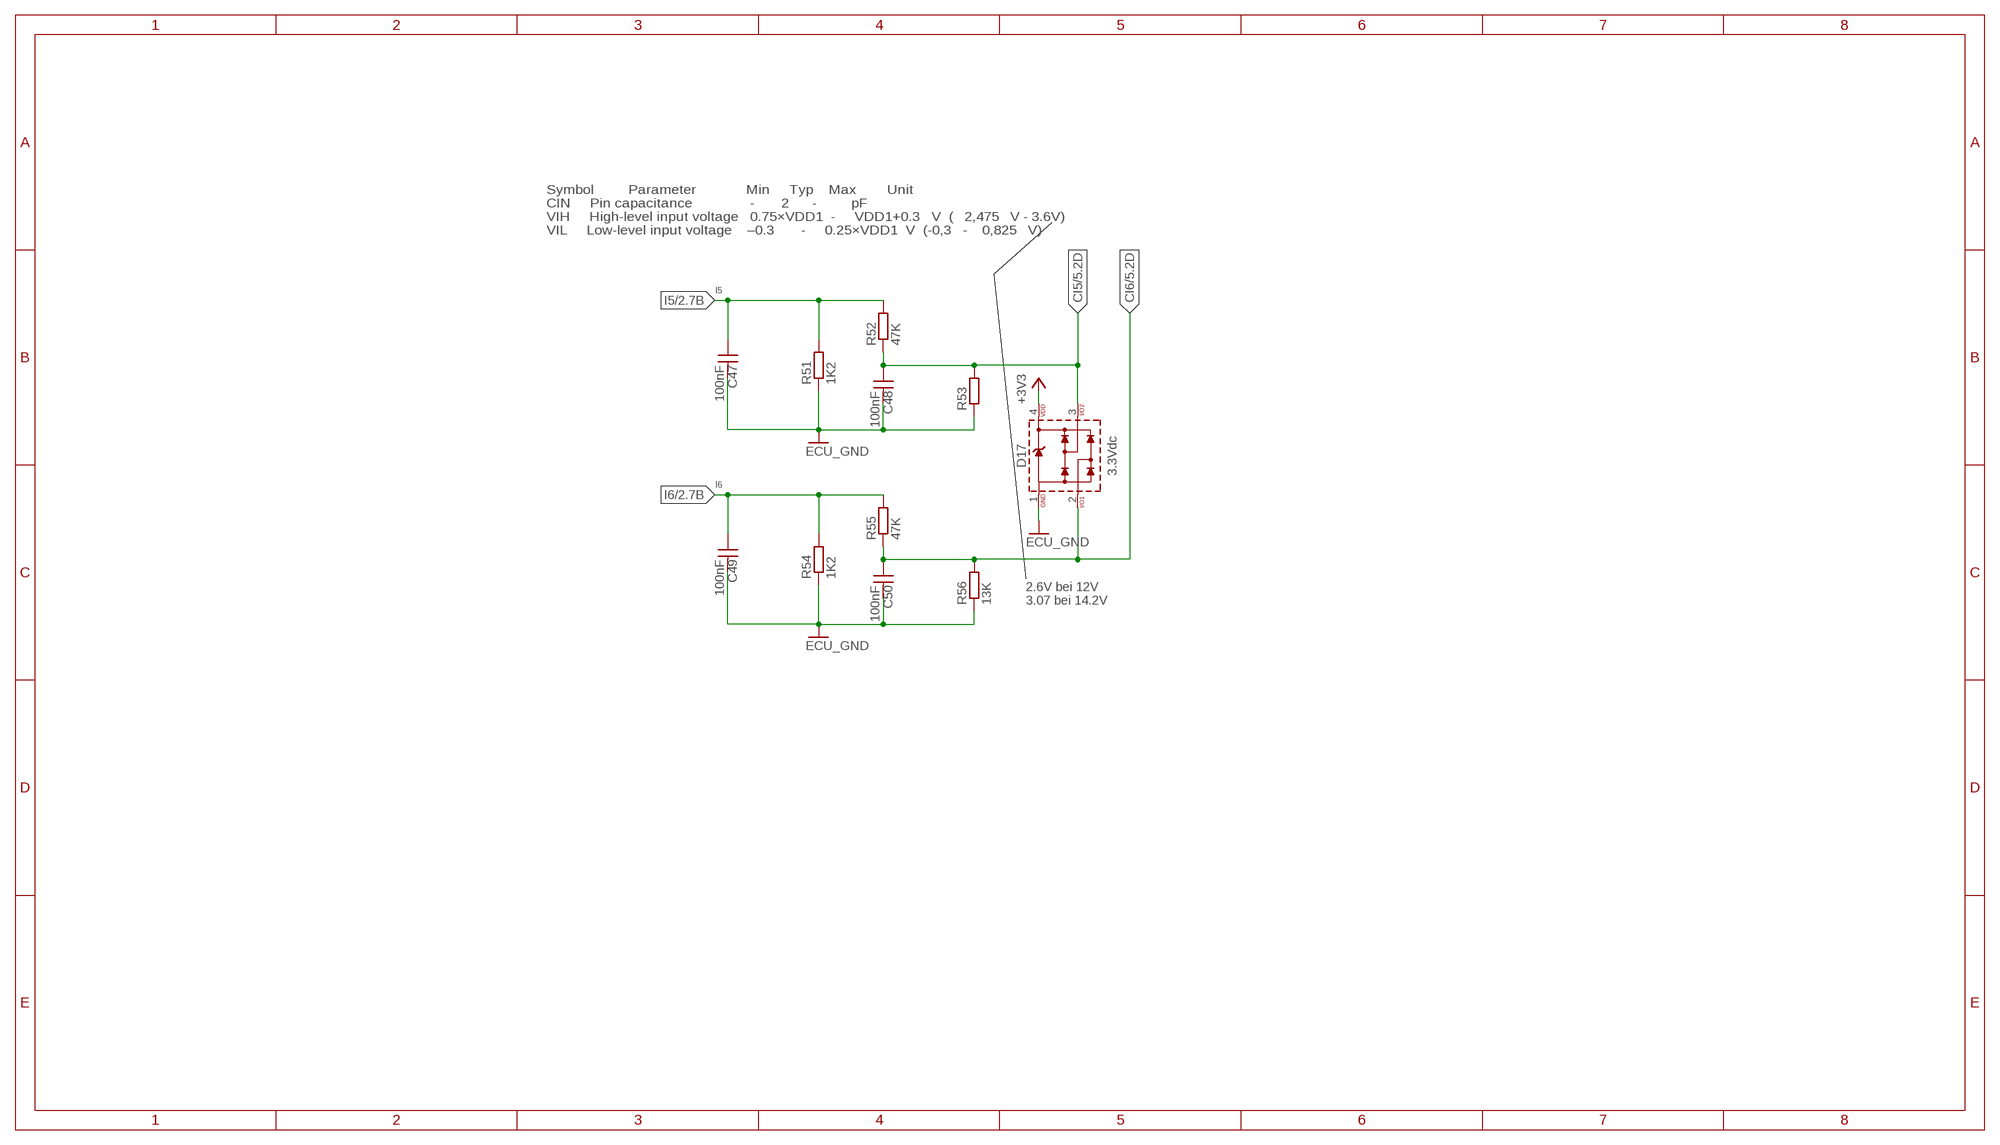
[diagram p9: schematic, sheet 10]

### Parts
C47  100nF  WCAP-CSGP_1206_H0.8_885012208087_50V(DC)  [WCAP-CSGP_1206_H0.8]
C48  100nF  WCAP-CSGP_1206_H0.8_885012208087_50V(DC)  [WCAP-CSGP_1206_H0.8]
C49  100nF  WCAP-CSGP_1206_H0.8_885012208087_50V(DC)  [WCAP-CSGP_1206_H0.8]
C50  100nF  WCAP-CSGP_1206_H0.8_885012208087_50V(DC)  [WCAP-CSGP_1206_H0.8]
D17  3.3Vdc  WE-TVS-HS_SOT143-4L_8240136  [WE-TVS_SOT143-4L]
R51  1K2  R-EU_R1206  [R1206]
R52  47K  R-EU_R1206  [R1206]
R53  13K  R-EU_R1206  [R1206]
R54  1K2  R-EU_R1206  [R1206]
R55  47K  R-EU_R1206  [R1206]
R56  13K  R-EU_R1206  [R1206]

### Nets
+3V3: D17.4(VDD) ; also sheet 4,5,8,9,11
CI5: C48.1 D17.3 R52.1 R53.2 ; also sheet 5
CI6: C50.1 D17.2 R55.1 R56.2 ; also sheet 5
ECU_GND [GND]: C47.2 C48.2 C49.2 C50.2 D17.1(GND) R51.1 R53.1 R54.1 R56.1 ; also sheet 2,3,4,5,6,7,8,9,11
I5: C47.1 R51.2 R52.2 ; also sheet 2
I6: C49.1 R54.2 R55.2 ; also sheet 2

### Notes on the sheet
- Symbol         Parameter             Min     Typ    Max        Unit
  CIN     Pin capacitance               -       2      -         pF
  VIH     High-level input voltage   0.75×VDD1  -     VDD1+0.3   V  (‭2,475‬V - 3.6V)
  VIL     Low-level input voltage    –0.3       -     0.25×VDD1  V  (-0,3   - ‭0,825‬V)
- 2.6V bei 12V
  3.07 bei 14.2V

## Sheet 11 of 11
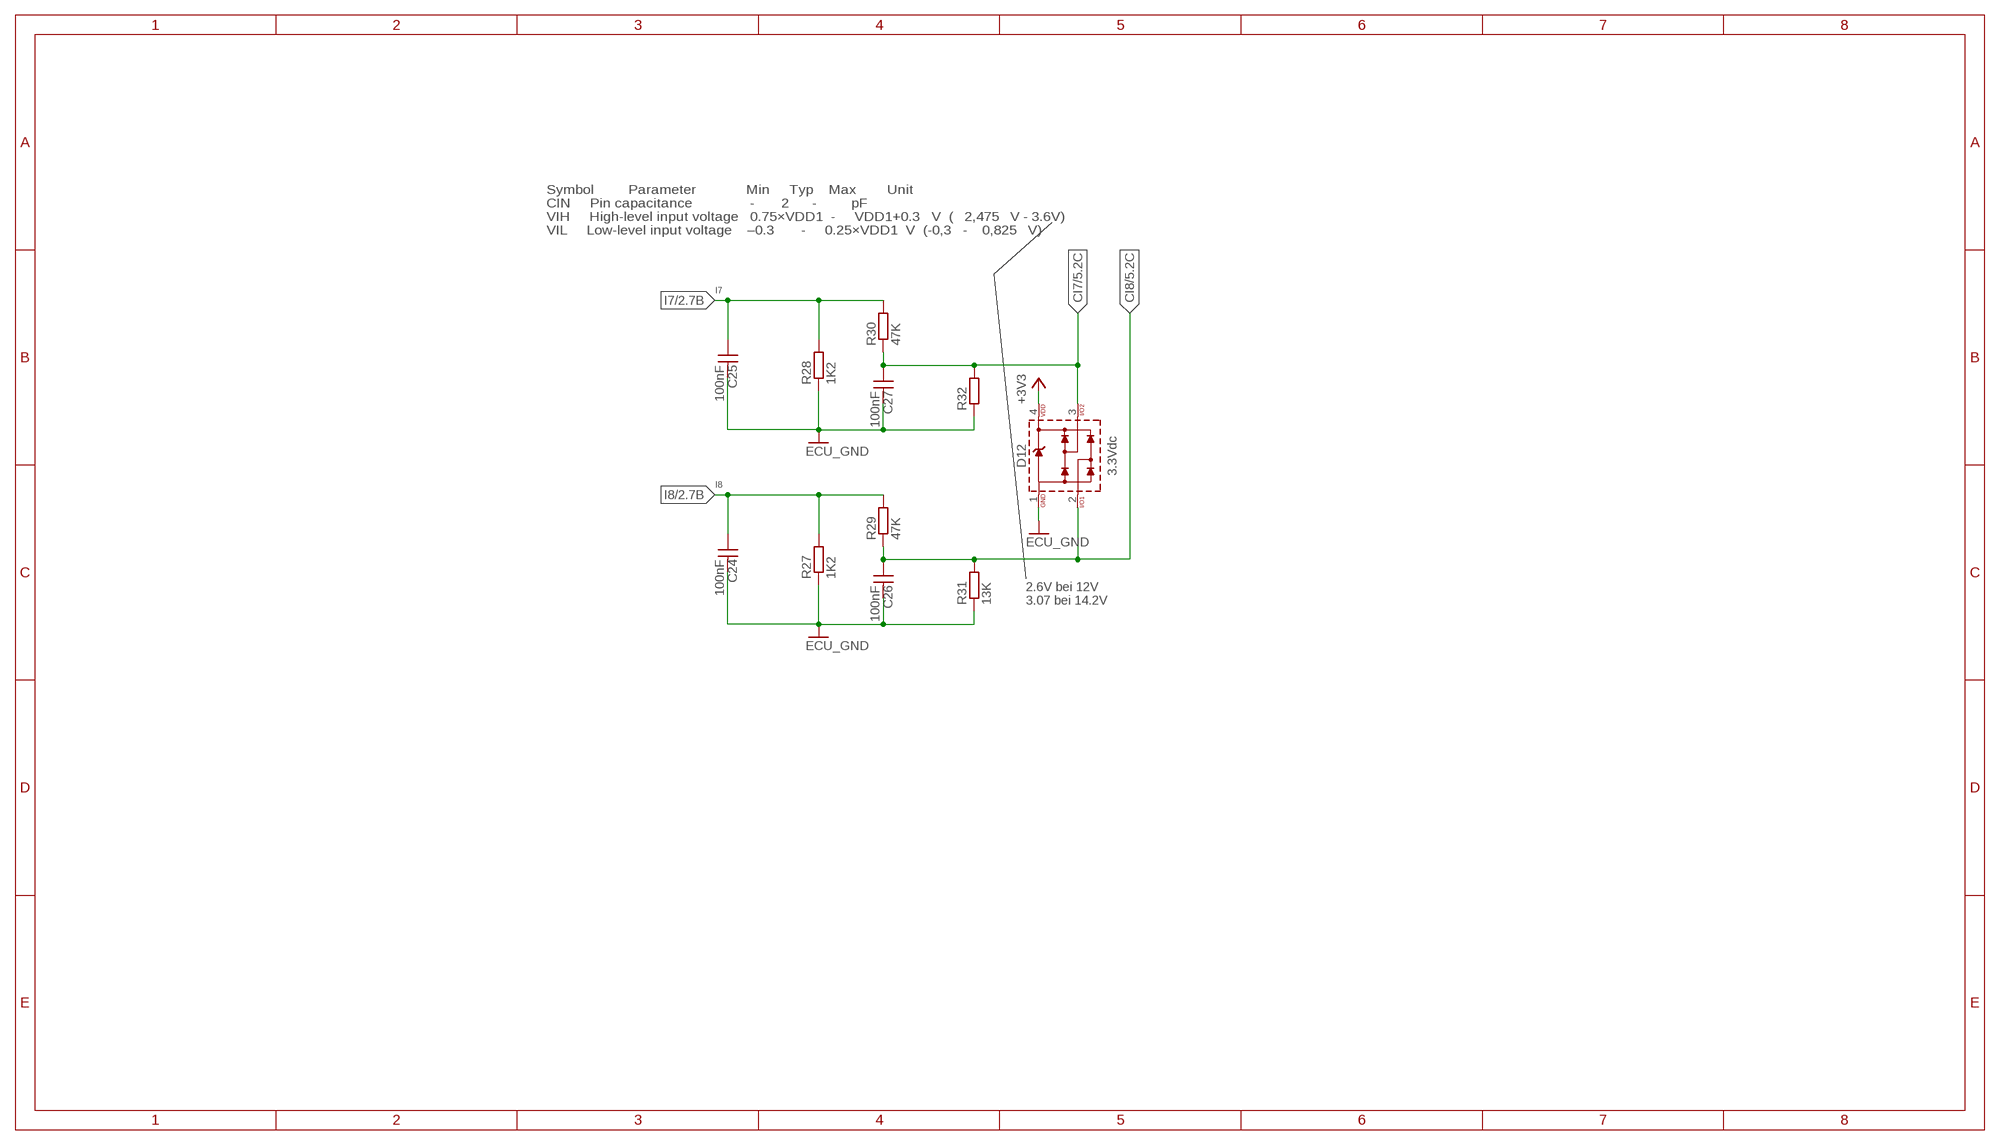
[diagram p10: schematic, sheet 11]

### Parts
C24  100nF  WCAP-CSGP_1206_H0.8_885012208087_50V(DC)  [WCAP-CSGP_1206_H0.8]
C25  100nF  WCAP-CSGP_1206_H0.8_885012208087_50V(DC)  [WCAP-CSGP_1206_H0.8]
C26  100nF  WCAP-CSGP_1206_H0.8_885012208087_50V(DC)  [WCAP-CSGP_1206_H0.8]
C27  100nF  WCAP-CSGP_1206_H0.8_885012208087_50V(DC)  [WCAP-CSGP_1206_H0.8]
D12  3.3Vdc  WE-TVS-HS_SOT143-4L_8240136  [WE-TVS_SOT143-4L]
R27  1K2  R-EU_R1206  [R1206]
R28  1K2  R-EU_R1206  [R1206]
R29  47K  R-EU_R1206  [R1206]
R30  47K  R-EU_R1206  [R1206]
R31  13K  R-EU_R1206  [R1206]
R32  13K  R-EU_R1206  [R1206]

### Nets
+3V3: D12.4(VDD) ; also sheet 4,5,8,9,10
CI7: C27.1 D12.3 R30.1 R32.2 ; also sheet 5
CI8: C26.1 D12.2 R29.1 R31.2 ; also sheet 5
ECU_GND [GND]: C24.2 C25.2 C26.2 C27.2 D12.1(GND) R27.1 R28.1 R31.1 R32.1 ; also sheet 2,3,4,5,6,7,8,9,10
I7: C25.1 R28.2 R30.2 ; also sheet 2
I8: C24.1 R27.2 R29.2 ; also sheet 2

### Notes on the sheet
- Symbol         Parameter             Min     Typ    Max        Unit
  CIN     Pin capacitance               -       2      -         pF
  VIH     High-level input voltage   0.75×VDD1  -     VDD1+0.3   V  (‭2,475‬V - 3.6V)
  VIL     Low-level input voltage    –0.3       -     0.25×VDD1  V  (-0,3   - ‭0,825‬V)
- 2.6V bei 12V
  3.07 bei 14.2V

## Library data of the parts
C1-C3 C5 C6 C13 C17-C20 = Wurth_Capacitors_WCAP-CSGP:WCAP-CSGP_0805_H0.8: WCAP-CSGP MLCCs 0805 Characteristics General purpose product series High performance ceramic High electrical precision and stability ceramic especially for NP0 Minimal aging especially for NP0 Mounting style: SMT-Chip Ceramic: NP0 (Class I), X5R (Class II), X7R (Class II) Temperature coefficient: ±30 ppm/°C; ±0.54 % for NP0 ±15 % for X5R and X7R Operating temperature: -55 °C up to + 125 °C for NP0 and X7R -55 °C up to + 85 °C for X5R Termination: Cu/Ni/Sn Recommended soldering: Reflow soldering Wave soldering for size 0603 Wave soldering for size 0805 (only valid for the thickness ≤0.85 mm) Applications Temperature compensation (NP0) Coupling Decoupling Bypass Smoothing Filtering Resonant circuit <https://www.we-online.com/catalog/media/o177837v209%20MLCC_GRP_all.jpg> Details see: https://www.we-online.com/catalog/en/pbs/capacitors/multilayer_ceramic_chip_capacitors/mlcc_general_purpose Updated by Ella Wu 2022-02-15 2022(C) Würth Elektronik; CERAMIC-TYPE: X7R Class II; DATASHEET-URL: https://www.we-online.com/redexpert/spec/885012207098?ae; DF: 2.5%; HEIGHT: 0.8mm; MOUNT: SMT; OPERATING-TEMPERATURE: -55 up to +125 °C; PART-NUMBER: 885012207098; QMIN: -; RISO: 5GOhm; SIZE: 0805; TECHNICAL-REFERENCE: X7R0805104K050DFCT10000; VR: 50V(DC)
C4 C7-C9 C14 C16 C21 C22 = Wurth_Capacitors_WCAP-CSGP:WCAP-CSGP_0805_H0.8: WCAP-CSGP MLCCs 0805 Characteristics General purpose product series High performance ceramic High electrical precision and stability ceramic especially for NP0 Minimal aging especially for NP0 Mounting style: SMT-Chip Ceramic: NP0 (Class I), X5R (Class II), X7R (Class II) Temperature coefficient: ±30 ppm/°C; ±0.54 % for NP0 ±15 % for X5R and X7R Operating temperature: -55 °C up to + 125 °C for NP0 and X7R -55 °C up to + 85 °C for X5R Termination: Cu/Ni/Sn Recommended soldering: Reflow soldering Wave soldering for size 0603 Wave soldering for size 0805 (only valid for the thickness ≤0.85 mm) Applications Temperature compensation (NP0) Coupling Decoupling Bypass Smoothing Filtering Resonant circuit <https://www.we-online.com/catalog/media/o177837v209%20MLCC_GRP_all.jpg> Details see: https://www.we-online.com/catalog/en/pbs/capacitors/multilayer_ceramic_chip_capacitors/mlcc_general_purpose Updated by Ella Wu 2022-02-15 2022(C) Würth Elektronik; CERAMIC-TYPE: X7R Class II; DATASHEET-URL: https://www.we-online.com/redexpert/spec/885012207092?ae; DF: 2.5%; HEIGHT: 0.8mm; MOUNT: SMT; OPERATING-TEMPERATURE: -55 up to +125 °C; PART-NUMBER: 885012207092; QMIN: -; RISO: 10GOhm; SIZE: 0805; TECHNICAL-REFERENCE: X7R0805103K050DFCT10000; VR: 50V(DC)
C10 = Wurth_Capacitors_WCAP-CSGP:WCAP-CSGP_1210_H2.5: WCAP-CSGP MLCCs 1210 Characteristics General purpose product series High performance ceramic High electrical precision and stability ceramic especially for NP0 Minimal aging especially for NP0 Mounting style: SMT-Chip Ceramic: NP0 (Class I), X5R (Class II), X7R (Class II) Temperature coefficient: ±30 ppm/°C; ±0.54 % for NP0 ±15 % for X5R and X7R Operating temperature: -55 °C up to + 125 °C for NP0 and X7R -55 °C up to + 85 °C for X5R Termination: Cu/Ni/Sn Recommended soldering: Reflow soldering Wave soldering for size 0603 Wave soldering for size 0805 (only valid for the thickness ≤0.85 mm) Applications Temperature compensation (NP0) Coupling Decoupling Bypass Smoothing Filtering Resonant circuit <https://www.we-online.com/catalog/media/o177837v209%20MLCC_GRP_all.jpg> Details see: https://www.we-online.com/catalog/en/pbs/capacitors/multilayer_ceramic_chip_capacitors/mlcc_general_purpose Updated by Ella Wu 2022-02-18 2022(C) Würth Elektronik; CERAMIC-TYPE: X5R Class II; DATASHEET-URL: https://www.we-online.com/redexpert/spec/885012109014?ae; DF: 5%; HEIGHT: 2.5mm; MOUNT: SMT; OPERATING-TEMPERATURE: -55 up to +85 °C; PART-NUMBER: 885012109014; QMIN: -; RISO: 0.005GOhm; SIZE: 1210; TECHNICAL-REFERENCE: X5R1210226M025DFCT10000; VR: 25V(DC)
C12 = Wurth_Capacitors_WCAP-CSGP:WCAP-CSGP_0805_H1.25: WCAP-CSGP MLCCs 0805 General Purpose Characteristics General purpose product series High performance ceramic High electrical precision and stability ceramic especially for NP0 Minimal aging especially for NP0 Mounting style: SMT-Chip Ceramic: NP0 (Class I), X5R (Class II), X7R (Class II) Temperature coefficient: ±30 ppm/°C; ±0.54 % for NP0 ±15 % for X5R and X7R Operating temperature: -55 °C up to + 125 °C for NP0 and X7R -55 °C up to + 85 °C for X5R Termination: Cu/Ni/Sn Recommended soldering: Reflow soldering Wave soldering for size 0603 Wave soldering for size 0805 (only valid for the thickness ≤0.85 mm) Applications Temperature compensation (NP0) Coupling Decoupling Bypass Smoothing Filtering Resonant circuit <https://www.we-online.com/catalog/media/o177837v209%20MLCC_GRP_all.jpg> Details see: https://www.we-online.com/catalog/en/pbs/capacitors/multilayer_ceramic_chip_capacitors/mlcc_general_purpose Updated by Ella Wu 2022-09-02 2022(C) Würth Elektronik; CERAMIC-TYPE: X5R Class II; DATASHEET-URL: https://www.we-online.com/redexpert/spec/885012107011?ae; DF: 10%; HEIGHT: 1.25mm; MOUNT: SMT; OPERATING-TEMPERATURE: -55 up to +85 °C; PART-NUMBER: 885012107011; QMIN: -; RISO: 0.005GOhm; SIZE: 0805; TECHNICAL-REFERENCE: X5R0805226M010DFCT10000; VR: 10V(DC)
C15 = Wurth_Capacitors_WCAP-CSGP:WCAP-CSGP_0805_H0.8: WCAP-CSGP MLCCs 0805 Characteristics General purpose product series High performance ceramic High electrical precision and stability ceramic especially for NP0 Minimal aging especially for NP0 Mounting style: SMT-Chip Ceramic: NP0 (Class I), X5R (Class II), X7R (Class II) Temperature coefficient: ±30 ppm/°C; ±0.54 % for NP0 ±15 % for X5R and X7R Operating temperature: -55 °C up to + 125 °C for NP0 and X7R -55 °C up to + 85 °C for X5R Termination: Cu/Ni/Sn Recommended soldering: Reflow soldering Wave soldering for size 0603 Wave soldering for size 0805 (only valid for the thickness ≤0.85 mm) Applications Temperature compensation (NP0) Coupling Decoupling Bypass Smoothing Filtering Resonant circuit <https://www.we-online.com/catalog/media/o177837v209%20MLCC_GRP_all.jpg> Details see: https://www.we-online.com/catalog/en/pbs/capacitors/multilayer_ceramic_chip_capacitors/mlcc_general_purpose Updated by Ella Wu 2022-02-15 2022(C) Würth Elektronik; CERAMIC-TYPE: X7R Class II; DATASHEET-URL: https://www.we-online.com/redexpert/spec/885012207096?ae; DF: 2.5%; HEIGHT: 0.8mm; MOUNT: SMT; OPERATING-TEMPERATURE: -55 up to +125 °C; PART-NUMBER: 885012207096; QMIN: -; RISO: 10GOhm; SIZE: 0805; TECHNICAL-REFERENCE: X7R0805473K050DFCT10000; VR: 50V(DC)
C23 = Wurth_Capacitors_WCAP-ASLI:WCAP-ASLI_12.5X14: WCAP-ASLI Aluminium Electrolytic Capacitors Low Impedance +105 °C Characteristics Low impedance product series Mounting style: V-Chip SMT Capacitance range: 0.1 µF ‒ 6800 µF Capacitance tolerance: ±20 % Voltage range (UR): 6.3 ‒ 100 V(DC) Operating temperature: -55 °C up to +105 °C Endurance: 2000 h @ +105 °C Dimensions (DxL) in mm: 4.0 x 5.5 up to 16.0 x 17.0 Recommended soldering: Reflow soldering Applications Low impedance, especially for filtering applications Input and output capacitor for switched-mode power supply Filtering Smoothing e.g. DC/DC converter, AC/DC converter, satellite receiver, control panel <https://www.we-online.com/catalog/media/o14723v209%20Family_WCAP-ASLI.jpg> Details see: https://www.we-online.com/catalog/en/WCAP-ASLI/ Updated by yingchun,Shan;2020-03-03 2020(C) Würth Elektronik; DATASHEET-URL: https://www.we-online.com/catalog/datasheet/865080662019.pdf; DF: 12%; DIAMETER: 12.5mm; I-LEAK: 165uA; I-RIPPLE: 800mA; L: 14mm; OPERATING-TEMPERATURE: -55 °C up to +105 °C; PART-NUMBER: 865080662019; TECHNICAL-REFERENCE: ASEH140331M050DVCTGB000; VR: 50V(DC)
C24-C27 C31-C34 C39-C42 C47-C50 = Wurth_Capacitors_WCAP-CSGP:WCAP-CSGP_1206_H0.8: WCAP-CSGP MLCCs 1206 Characteristics General purpose product series High performance ceramic High electrical precision and stability ceramic especially for NP0 Minimal aging especially for NP0 Mounting style: SMT-Chip Ceramic: NP0 (Class I), X5R (Class II), X7R (Class II) Temperature coefficient: ±30 ppm/°C; ±0.54 % for NP0 ±15 % for X5R and X7R Operating temperature: -55 °C up to + 125 °C for NP0 and X7R -55 °C up to + 85 °C for X5R Termination: Cu/Ni/Sn Recommended soldering: Reflow soldering Wave soldering for size 0603 Wave soldering for size 0805 (only valid for the thickness ≤0.85 mm) Applications Temperature compensation (NP0) Coupling Decoupling Bypass Smoothing Filtering Resonant circuit <https://www.we-online.com/catalog/media/o177837v209%20MLCC_GRP_all.jpg> Details see: https://www.we-online.com/catalog/en/pbs/capacitors/multilayer_ceramic_chip_capacitors/mlcc_general_purpose Updated by yingchun,Shan;2020-03-09 2020(C) Würth Elektronik; CERAMIC-TYPE: X7R Class II; DATASHEET-URL: https://www.we-online.com/redexpert/spec/885012208087?ae; DF: 2.5%; HEIGHT: 0.8mm; MOUNT: SMT; OPERATING-TEMPERATURE: -55 up to +125 °C; PART-NUMBER: 885012208087; QMIN: -; RISO: 5GOhm; SIZE: 1206; TECHNICAL-REFERENCE: X7R1206104K050DFCT1000; VR: 50V(DC)
D0 D5 = Wurth_EMC Components_WE-TVSP:WE-TVSP_DO-214AB_3000W_BI: WE-TVSP Power TVS Diode Characteristics Low Profile Package Glass passivated Juction Excellent clamping capability Fast response time MSL Level 1, per J-STD-020 Classification of the plastic case: UL 94 V-0 Safety certification UL 497B, E478010 Identical design: - DO-214AC = SMAJ - DO-214AA = SMBJ - DO-214AB = SMCJ/SMDJ Applications Ideal to protect the I/O Interfaces, Bus Voltage and other circuits of sensetive electronic equipment against voltage transiensts <https://www.we-online.com/catalog/media/o55793v209%20WE-TVSP_600W-3000W_D0214AA_4C.jpg> Details see: https://www.we-online.com/catalog/en/WE-TVSP/ Updated by Ella Wu 2020-07-20 2020 (C) Würth Elektronik; DATASHEET-URL: https://www.we-online.com/catalog/datasheet/824551331.pdf; IPEAK: 56.3A; MOUNT: SMT; PART-NUMBER: 824551331; PDISS: 3000W; VBR: 38.65V; VCLAMP: 53.3V
D1-D4 D7-D10 = Wurth_LEDs_WL-SMTW:WL-SMTW_3528: WL-SMTW SMT Mono-color TOP LED Waterclear Characteristics Low energy consumption High reliability Low current requirement Fast switching No UV/IR radiation Slim Miniature size Flexibility in design Top view LED PLCC 2 white package Compact package outline, ideal for miniature applications Variety of colors Applications Signage and indirect illumination Flat lamp Indicator and backlight in telecommunication Consumer application: dash-board, telephone or A/V equipments Flat backlight for LCDs, switches and symbols Optical indicators Indoor and outdoor displays Scanner Backlight in LCD, cellular phones, switches, keys, displays lluminated advertising, panel Lighting device: indicator, general lighting Camera flash, hand carrier flash Coupling into light guides <https://www.we-online.com/catalog/media/o14908v209%20WL-SMTW_150285BSxxx.jpg> Details see: https://www.we-online.com/catalog/en/WL-SMTW/ Updated by Yingchun Shan,2020-03-20 2020(C) Wurth Elektronik; CHIP-TECHNOLOGY: AlInGaP; DATASHEET-URL: https://www.we-online.com/catalog/datasheet/150141VS73100.pdf; EMITTING-COLOR: Bright Green; I-V-TYP: 90mcd; LAMDA-DOM-TYP: 570nm; LAMDA-PEAK-TYP: 572nm; PART-NUMBER: 150141VS73100; PHI-V-TYP: -; V-F-TYP: 2V; VIEWING-ANGLE: 120°
D006 = fliegl-elektronik:MBRS3*0T3: SCHOTTKY BARRIER RECTIFIER 3.0 AMPERES 20, 30, 40 VOLT Source: MBRS340T3-D.pdf; ARTIKEL_NR: 513891
D11 = Wurth_EMC Components_WE-TVS:WE-TVS_SOT23-3L_824094024: WE-TVS TVS Diode – Standard Series Characteristics Fast turn-on Low clamping voltage High ESD withstand voltage Uni- or bidirectional protection Small package Epoxy flame resistant UL94 V-0 Applications DC power supply USB Power Delivery (PD) Headsets and accessories PDAs Digital cameras MP3-Player Touch Panels Notebooks ESD, EFT and Surge Protection ESD protection in accordance with EN 61000-4-2 – 8 kV contact discharge – 15 kV air discharge <https://www.we-online.com/catalog/media/o106433v209%20Family_WE-TVS_Standard.jpg> Details see: https://www.we-online.com/catalog/en/WE-TVS Created by Ella Wu 2021-12-15 2021 (C) Wurth Elektronik; C-CH: 38pF; CHANNELS: 2; DATASHEET-URL: https://www.we-online.com/catalog/datasheet/824094024.pdf; IPEAK: 6A; MOUNT: SMT; PART-NUMBER: 824094024; VBR: 26.2V
D12 D13 D15 D17 = Wurth_EMC Components_WE-TVS:WE-TVS-HS_SOT143-4L_8240136: WE-TVS TVS Diode – High Speed Series Characteristics Low clamping voltage Sturdy design Very low capacitance Flow Thru Design for a simple layout Rail to Rail protection Epoxy flame resistant UL94-V0 RoHS, REACH and free of halogens Applications Very fast data lines USB 2.0 Ethernet PoE VGA Sim Cards Keypads HS = High Speed <https://www.we-online.com/catalog/media/o14883v209%20Family_WE-TVS_HIGHSPEED.jpg> Details see: https://www.we-online.com/catalog/en/WE-TVS-HS Updated by Ella Wu 2019-07-12 2019 (C) Wurth Elektronik; C-CH: 3pF; CHANNELS: 2+1; DATASHEET-URL: https://www.we-online.com/catalog/datasheet/8240136.pdf; IPEAK: 12A; MOUNT: SMT; PART-NUMBER: 8240136; VBR: 4.5V
G1 = IFX27001TF V50:IFX27001TF_V50: IFX27001TF V50 INF-PG-TO252-3-11_N Linear Voltage Regulator, 4.7 to 40 V Supply, Fixed/Adjustable Output, -40 to 125 degC, PG-TO252-3, Reel, Green
J1 J7 J13 = Wurth_Connectors_WR-FAST:638207222005: WR-FAST 5.08 mm THT Male Header Vertical Blade 2863 KIND PROPERTIES Pitch 5.08 mm Gender Male MATERIAL PROPERTIES Insulator Material PC Insulator Flammability Rating UL94 V-0 Insulator Color Black Contact Material Steel Contact Plating Tin Contact Type Stamped GENERAL INFORMATION Operating Temperature -30 up to +120 °C Working Voltage 300 V (AC) Withstanding Voltage 1600 V (AC) Contact Resistance 20 mΩ RISO 5 MΩ IR 16 A CERTIFICATION cULus Approval E150931 PACKAGING PROPERTIES Packaging Box <https://www.we-online.com/catalog/media/o165124v209%20Family_ConFAST_638207222004.jpg> Details see: https://www.we-online.com/catalog/en/FAST_5_08_THT_MALE_VERTICAL_6382072220XX/ Updated by Ella Wu 2020-08-11 2020(C) Wurth Elektronik; CONTACT-RESISTANCE: 20mOhm; DATASHEET-URL: https://www.we-online.com/catalog/datasheet/638207222005.pdf; GENDER: Male; IR: 16A; MOUNT: THT; PART-NUMBER: 638207222005; PINS: 5; PITCH: 5.08mm; TYPE: Vertical; WORKING-VOLTAGE: 300V(AC)
J3 J6 = Wurth_Connectors_WR-PHD:6130XX11821_61302211821: WR-PHD 2.54 mm Socket Header ARTICLE PROPERTIES: Pins:1;​ 2;​ 3;​ 4;​ 5;​ 6;​ 7;​ 8;​ 9;​ 10;​ 12;​ 13;​ 14;​ 15;​ 16;​ 18;​ 20;​ 22;​ 24;​ 25;​ 32;​ 36;​ 40 KIND PROPERTIES: Pitch：2.54 mm Quality Class:3 as per CECC 75 301-802 Rows：Single Gender：Socket Header;​ Female Type：Straight MATERIAL PROPERTIES: Insulator Material :PBT Insulator Flammability Rating:UL94 V-0 Contact Material:Copper Alloy Contact Plating:Gold Contact Type:Stamped GENERAL INFORMATION Operating Temperature:-40 up to +125 °C Compliance:Lead free / RoHS ELECTRICAL PROPERTIES: Rated Current:3 A IR 1:3 A Withstanding Voltage:500 V (AC) Contact Resistance:20 mΩ RISO:1000 MΩ CERTIFICATION UL Approval:E323964 PACKAGING PROPERTIES Packaging:Tray <https://katalog.we-online.com/media/images/v2/o33218v209%20Family_WR-PHD_613xxx11821.jpg> Details see: https://katalog.we-online.com/en/em/PHD_2_54_SOCKET_HEADER_6130XX11821 Updated by Yingchun,Shan 2019-10-21 2019 (C) Würth Elektronik; DATASHEET-URL: https://www.we-online.com/redexpert/spec/61302211821?ae; GENDER: Socket Header; IR: 3A; MOUNT: THT; PACKAGING: Tray; PART-NUMBER: 61302211821; PINS: 22; PITCH: 2.54mm; ROWS: Single; TYPE: Straight
J4 = Wurth_Connectors_WR-PHD:6130XX21121_61300421121: WR-PHD 2.54 mm THT Dual Pin Header ARTICLE PROPERTIES: Pins:4;​ 6;​ 8;​ 10;​ 12;​ 14;​ 16;​ 18;​ 20;​ 22;​ 24;​ 26;​ 28;​ 30;​ 32;​ 34;​ 36;​ 40;​ 44;​ 64;​ 72;​ 80 KIND PROPERTIES: Pitch：2.54 mm Quality Class:3 as per CECC 75 301-802 Rows：Dual Gender：Pin Header Type：Board Stacker MATERIAL PROPERTIES: Insulator Material :PA6T Insulator Flammability Rating:UL94 V-0 Contact Material:Copper Alloy Contact Plating:Gold Contact Type:Stamped GENERAL INFORMATION Operating Temperature:-40 up to +105 °C Compliance:Lead free / RoHS ELECTRICAL PROPERTIES: Rated Current:3 A IR 1:3 A Withstanding Voltage:500 V (AC) Contact Resistance:20 mΩ RISO:1000 MΩ CERTIFICATION UL Approval:E323964 PACKAGING PROPERTIES Packaging:Bag <https://katalog.we-online.com/media/images/v2/o33215v209%20Family_WR-PHD_6130xx21121.jpg> Details see: https://katalog.we-online.com/en/em/PHD_2_54_THT_DUAL_PIN_HEADER_6130XX21121 Updated by Yingchun,Shan 2019-10-16 2019 (C) Würth Elektronik; DATASHEET-URL: https://www.we-online.com/redexpert/spec/61300421121?ae; GENDER: Pin Header; IR: 3A; MOUNT: THT; PACKAGING: Bag; PART-NUMBER: 61300421121; PINS: 4; PITCH: 2.54mm; ROWS: Dual; TYPE: Board Stacker
J5 J9 = 6-pin-tht:6130XX21121_61300621121: WR-PHD 2.54 mm THT Dual Pin Header ARTICLE PROPERTIES: Pins:4;​ 6;​ 8;​ 10;​ 12;​ 14;​ 16;​ 18;​ 20;​ 22;​ 24;​ 26;​ 28;​ 30;​ 32;​ 34;​ 36;​ 40;​ 44;​ 64;​ 72;​ 80 KIND PROPERTIES: Pitch：2.54 mm Quality Class:3 as per CECC 75 301-802 Rows：Dual Gender：Pin Header Type：Board Stacker MATERIAL PROPERTIES: Insulator Material :PA6T Insulator Flammability Rating:UL94 V-0 Contact Material:Copper Alloy Contact Plating:Gold Contact Type:Stamped GENERAL INFORMATION Operating Temperature:-40 up to +105 °C Compliance:Lead free / RoHS ELECTRICAL PROPERTIES: Rated Current:3 A IR 1:3 A Withstanding Voltage:500 V (AC) Contact Resistance:20 mΩ RISO:1000 MΩ CERTIFICATION UL Approval:E323964 PACKAGING PROPERTIES Packaging:Bag <https://katalog.we-online.com/media/images/v2/o33215v209%20Family_WR-PHD_6130xx21121.jpg> Details see: https://katalog.we-online.com/en/em/PHD_2_54_THT_DUAL_PIN_HEADER_6130XX21121 Updated by Yingchun,Shan 2019-10-16 2019 (C) Würth Elektronik; DATASHEET-URL: https://katalog.we-online.com/em/datasheet/61300621121.pdf; GENDER: Pin Header; IR: 3A; MATES: WR-PHD 2.54mm Angled DualSocket Header/Dual Socket Header/Dual Socket Header Bottom Entry/Dual Socket Header Bottom Entry Large/SMT Dual Socket Header/SMT Dual Socket Header Bottom Entry; PACKAGING: Bag; PART-NUMBER: 61300621121; PINS: 6; ROWS: Dual; TYPE: Board Stacker
J8 = Wurth_Connectors_WR-FAST:638207222007: WR-FAST 5.08 mm THT Male Header Vertical Blade 2863 KIND PROPERTIES Pitch 5.08 mm Gender Male MATERIAL PROPERTIES Insulator Material PC Insulator Flammability Rating UL94 V-0 Insulator Color Black Contact Material Steel Contact Plating Tin Contact Type Stamped GENERAL INFORMATION Operating Temperature -30 up to +120 °C Working Voltage 300 V (AC) Withstanding Voltage 1600 V (AC) Contact Resistance 20 mΩ RISO 5 MΩ IR 16 A CERTIFICATION cULus Approval E150931 PACKAGING PROPERTIES Packaging Box <https://www.we-online.com/catalog/media/o165124v209%20Family_ConFAST_638207222004.jpg> Details see: https://www.we-online.com/catalog/en/FAST_5_08_THT_MALE_VERTICAL_6382072220XX/ Updated by Ella Wu 2020-08-11 2020(C) Wurth Elektronik; CONTACT-RESISTANCE: 20mOhm; DATASHEET-URL: https://www.we-online.com/catalog/datasheet/638207222007.pdf; GENDER: Male; IR: 16A; MOUNT: THT; PART-NUMBER: 638207222007; PINS: 7; PITCH: 5.08mm; TYPE: Vertical; WORKING-VOLTAGE: 300V(AC)
J15 = Wurth_Connectors_WR-FAST:638207222008: WR-FAST 5.08 mm THT Male Header Vertical Blade 2863 KIND PROPERTIES Pitch 5.08 mm Gender Male MATERIAL PROPERTIES Insulator Material PC Insulator Flammability Rating UL94 V-0 Insulator Color Black Contact Material Steel Contact Plating Tin Contact Type Stamped GENERAL INFORMATION Operating Temperature -30 up to +120 °C Working Voltage 300 V (AC) Withstanding Voltage 1600 V (AC) Contact Resistance 20 mΩ RISO 5 MΩ IR 16 A CERTIFICATION cULus Approval E150931 PACKAGING PROPERTIES Packaging Box <https://www.we-online.com/catalog/media/o165124v209%20Family_ConFAST_638207222004.jpg> Details see: https://www.we-online.com/catalog/en/FAST_5_08_THT_MALE_VERTICAL_6382072220XX/ Updated by Ella Wu 2020-08-11 2020(C) Wurth Elektronik; CONTACT-RESISTANCE: 20mOhm; DATASHEET-URL: https://www.we-online.com/catalog/datasheet/638207222008.pdf; GENDER: Male; IR: 16A; MOUNT: THT; PART-NUMBER: 638207222008; PINS: 8; PITCH: 5.08mm; TYPE: Vertical; WORKING-VOLTAGE: 300V(AC)
R1-R13 R18 R21-R32 R39-R44 R51-R56 RX1-RX8 = resistor:R-EU_: RESISTOR, European symbol
U1 = ESP32-S3-DEVKITC-1-N8R2:ESP32-S3-DEVKITC-1-N8R2: Check availability <https://pricing.snapeda.com/parts/ESP32-S3-DEVKITC-1-N8R2/Espressif%20Systems/view-part?ref=eda>; AVAILABILITY: In Stock; DESCRIPTION: WiFi Development Tools - 802.11 (Engineering Samples Only) ESP32-S3 General-Purpose Development Board, ESP32-S3-WROOM-1-N8R2, with Pin Header; MF: Espressif Systems; MP: ESP32-S3-DEVKITC-1-N8R2; PACKAGE: None; PRICE: None; PURCHASE-URL: https://pricing.snapeda.com/search/part/ESP32-S3-DEVKITC-1-N8R2/?ref=eda
U2 U3 U5 U6 = BTS7030-2EPA:BTS7030-2EPA: BTS7030-2EPA PROFET +2, Smart High-Side Power Switch 30 mOhm Dual Channel SOP65P600X115-15N-V
U4 = TLE9250VSJ:TLE9250VSJ: TLE9250VSJ SOIC127P602X173-8N-V High Speed CAN FD Transceiver; ARTIKEL_NR: 545599
X2 = con-JST VH:B4P-VH: JST VH Series header 3.96mm pitch disconnectable crimp style connectors, vertical (side entry type), 4 pins

## Net classes
1 GND: width 0.127 mm, clearance 0.127 mm to class 0

## Board
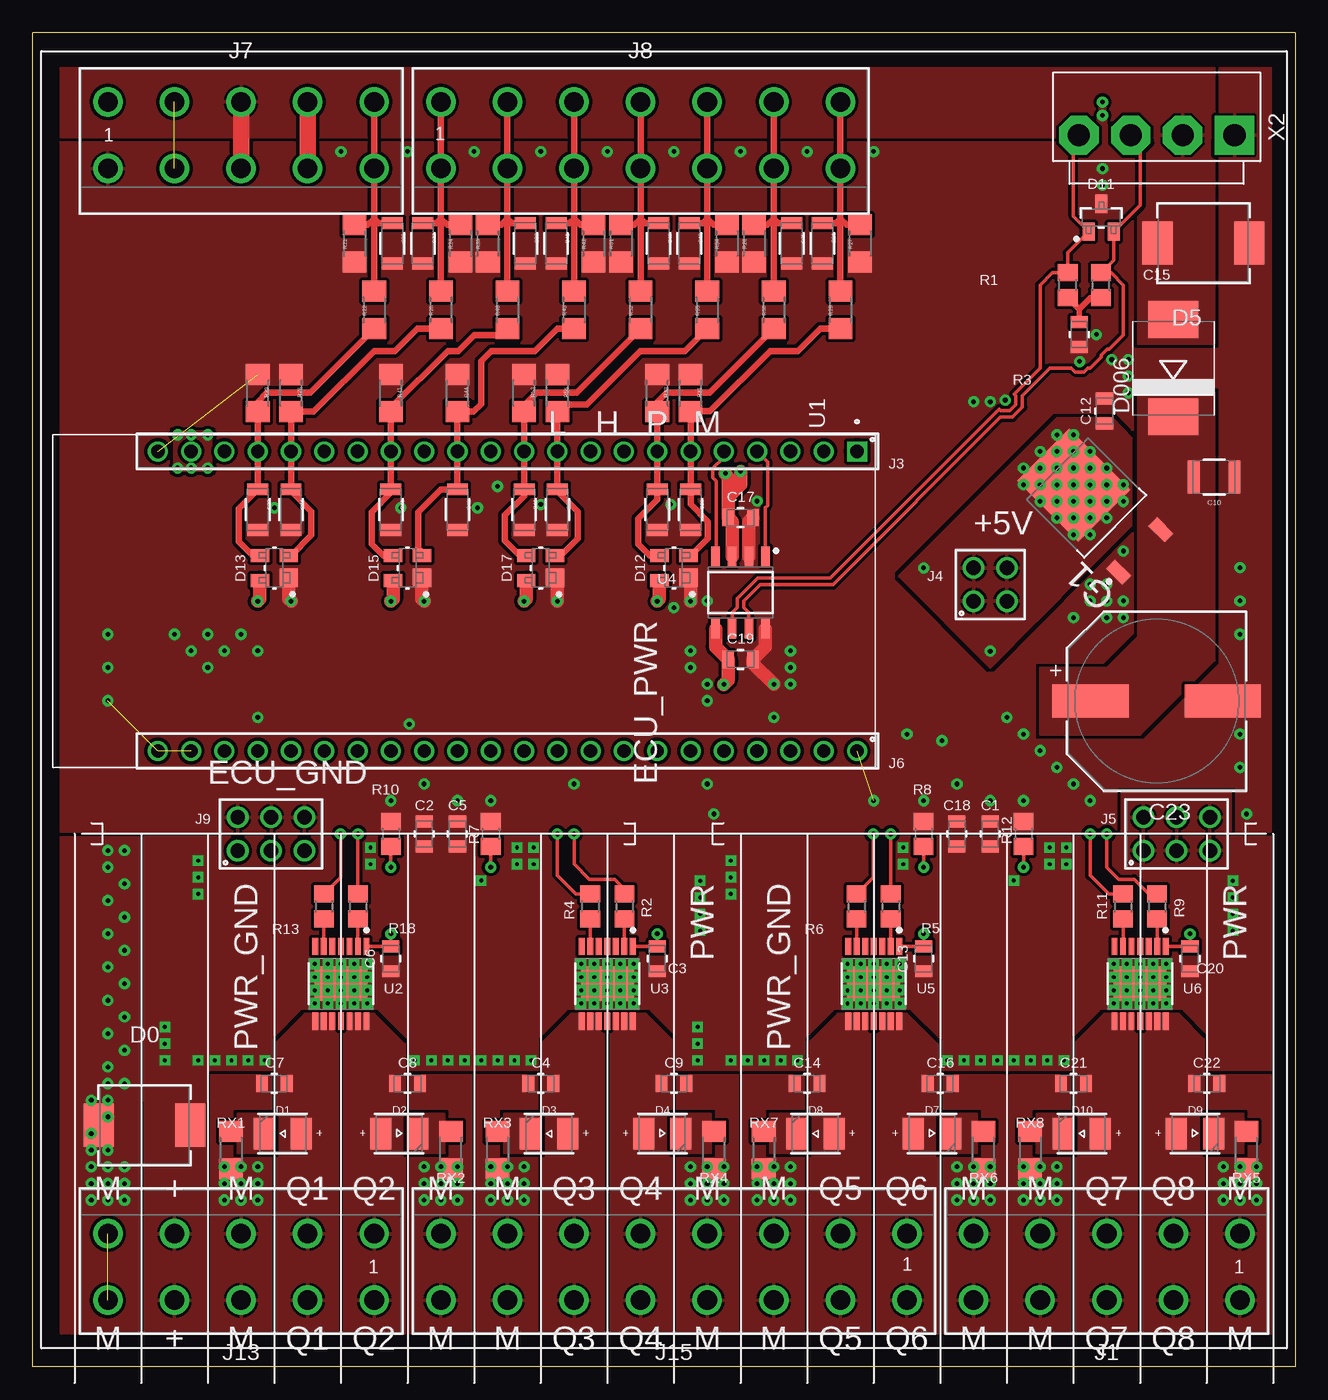
[diagram p11: board, top side]
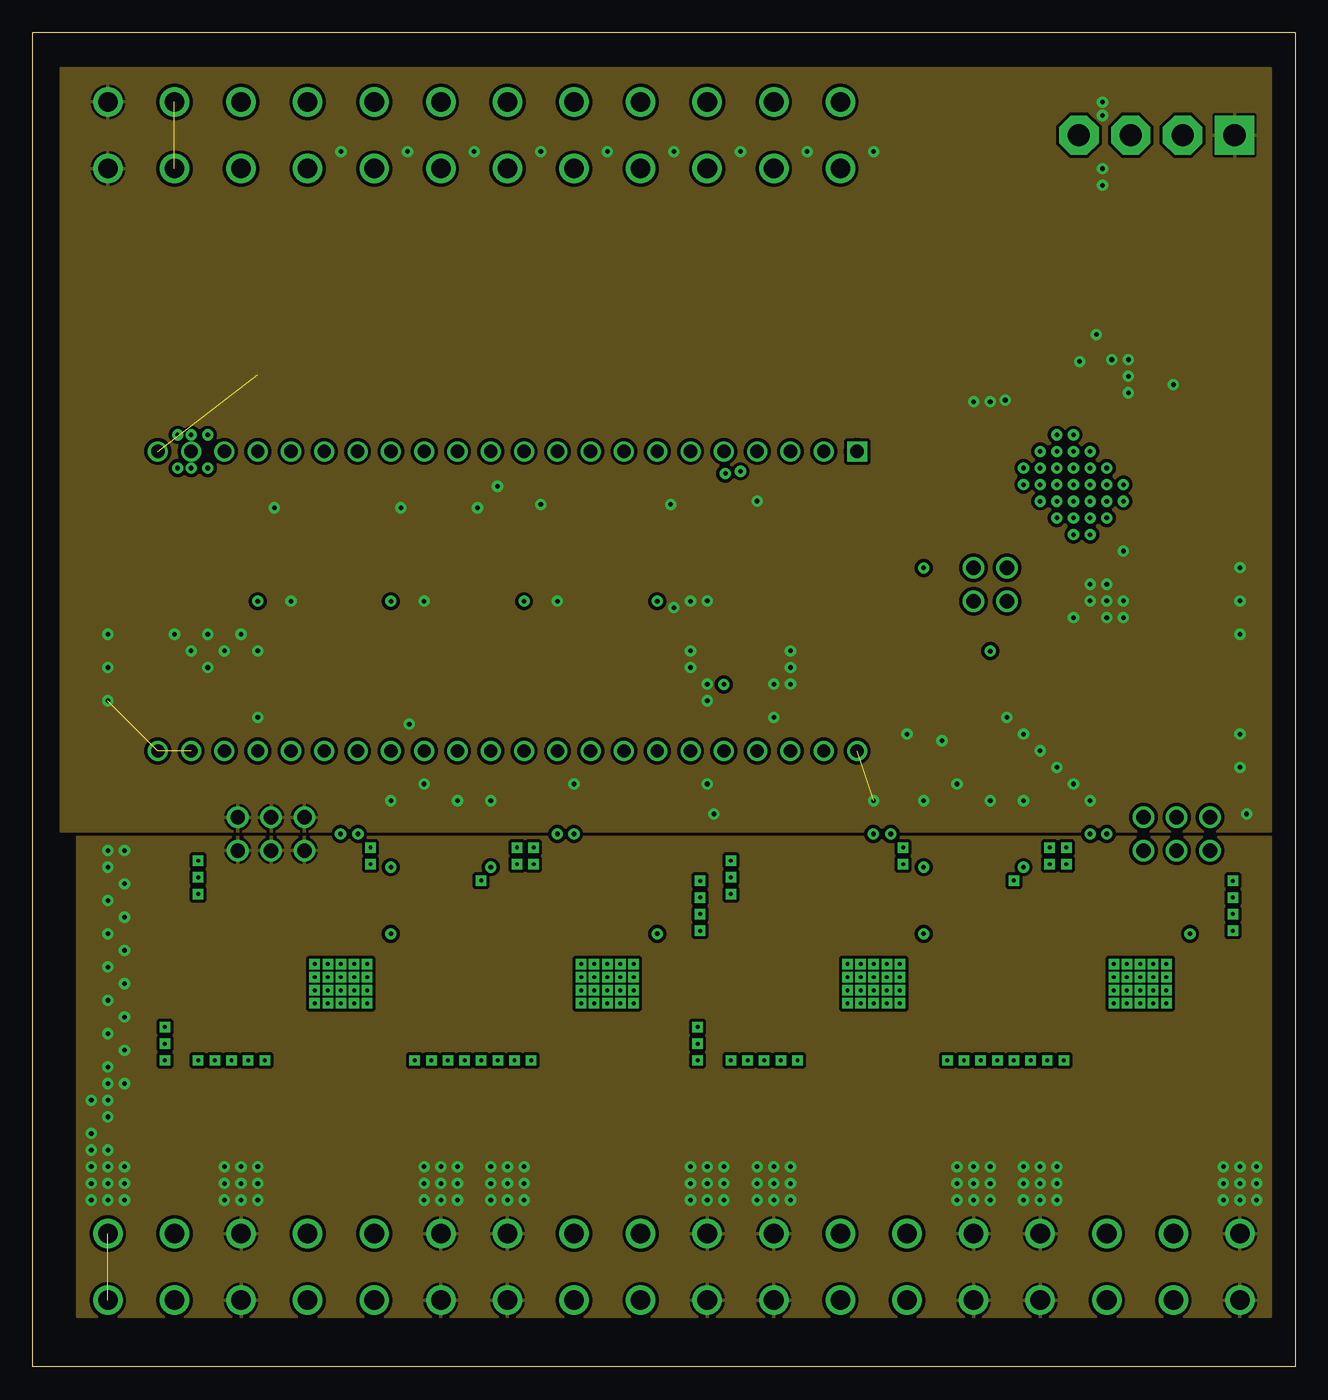
[diagram p12: board, inner layer Route2]
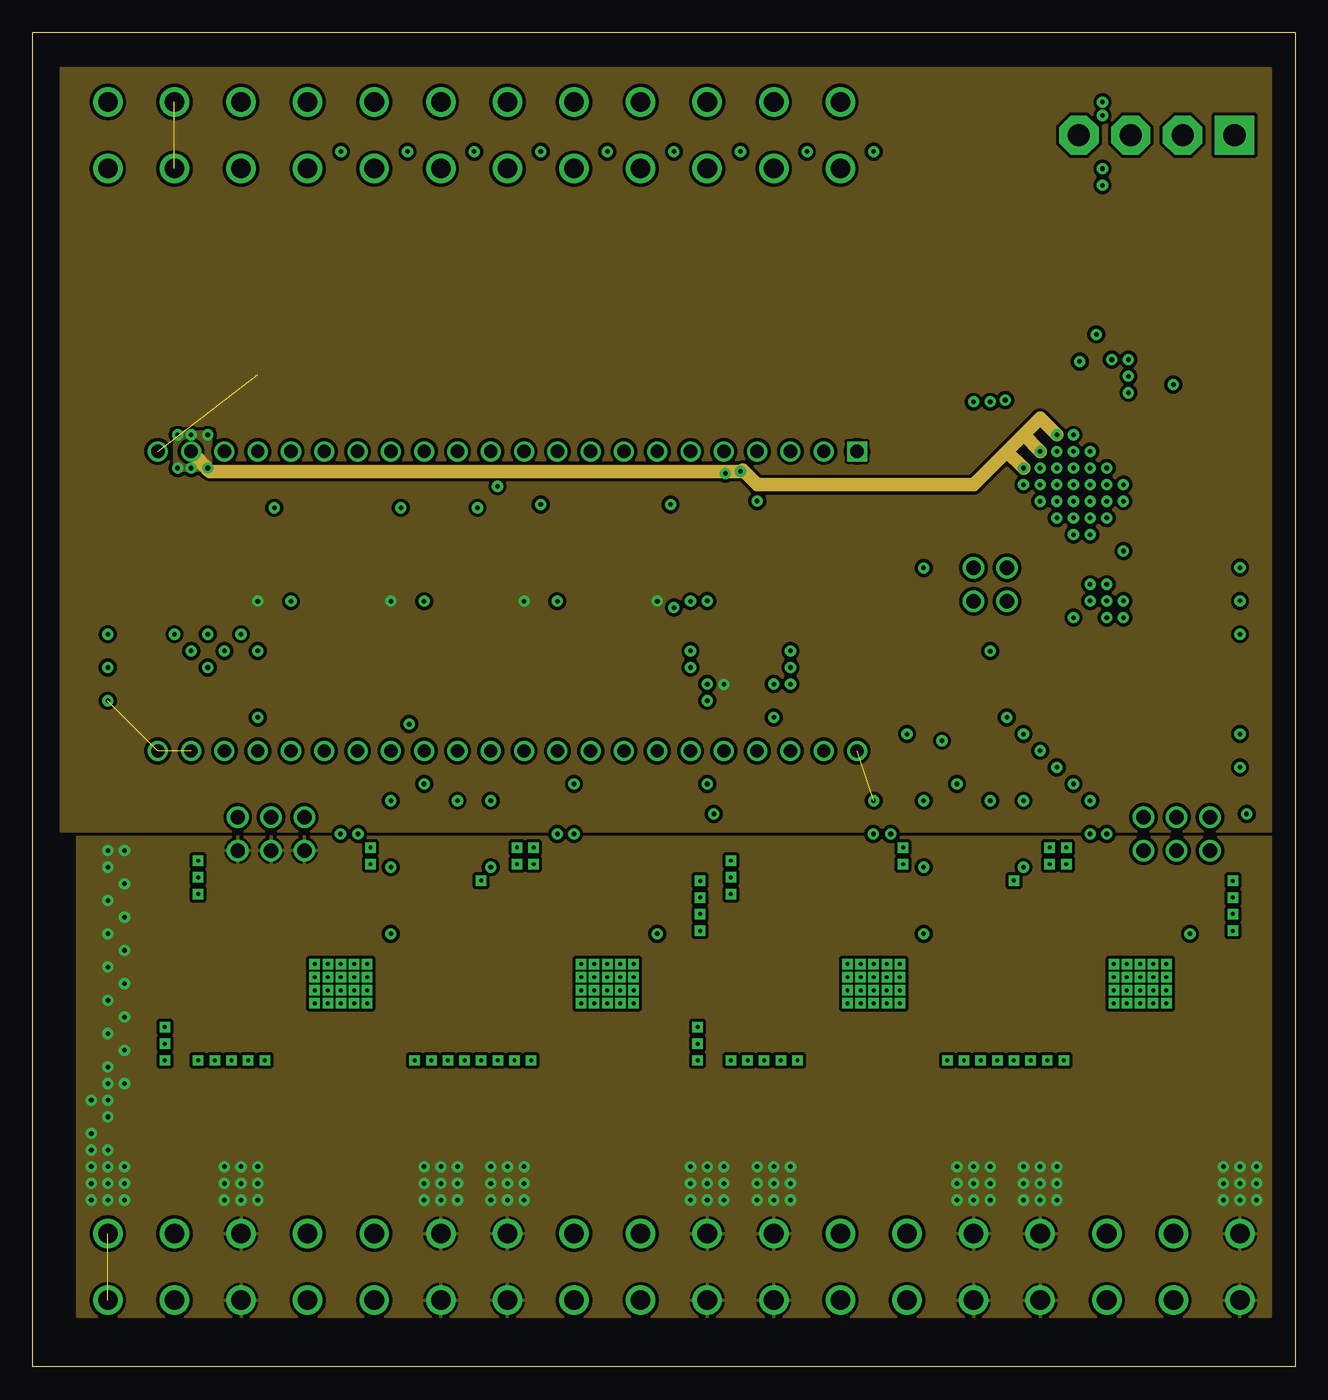
[diagram p13: board, inner layer Route15]
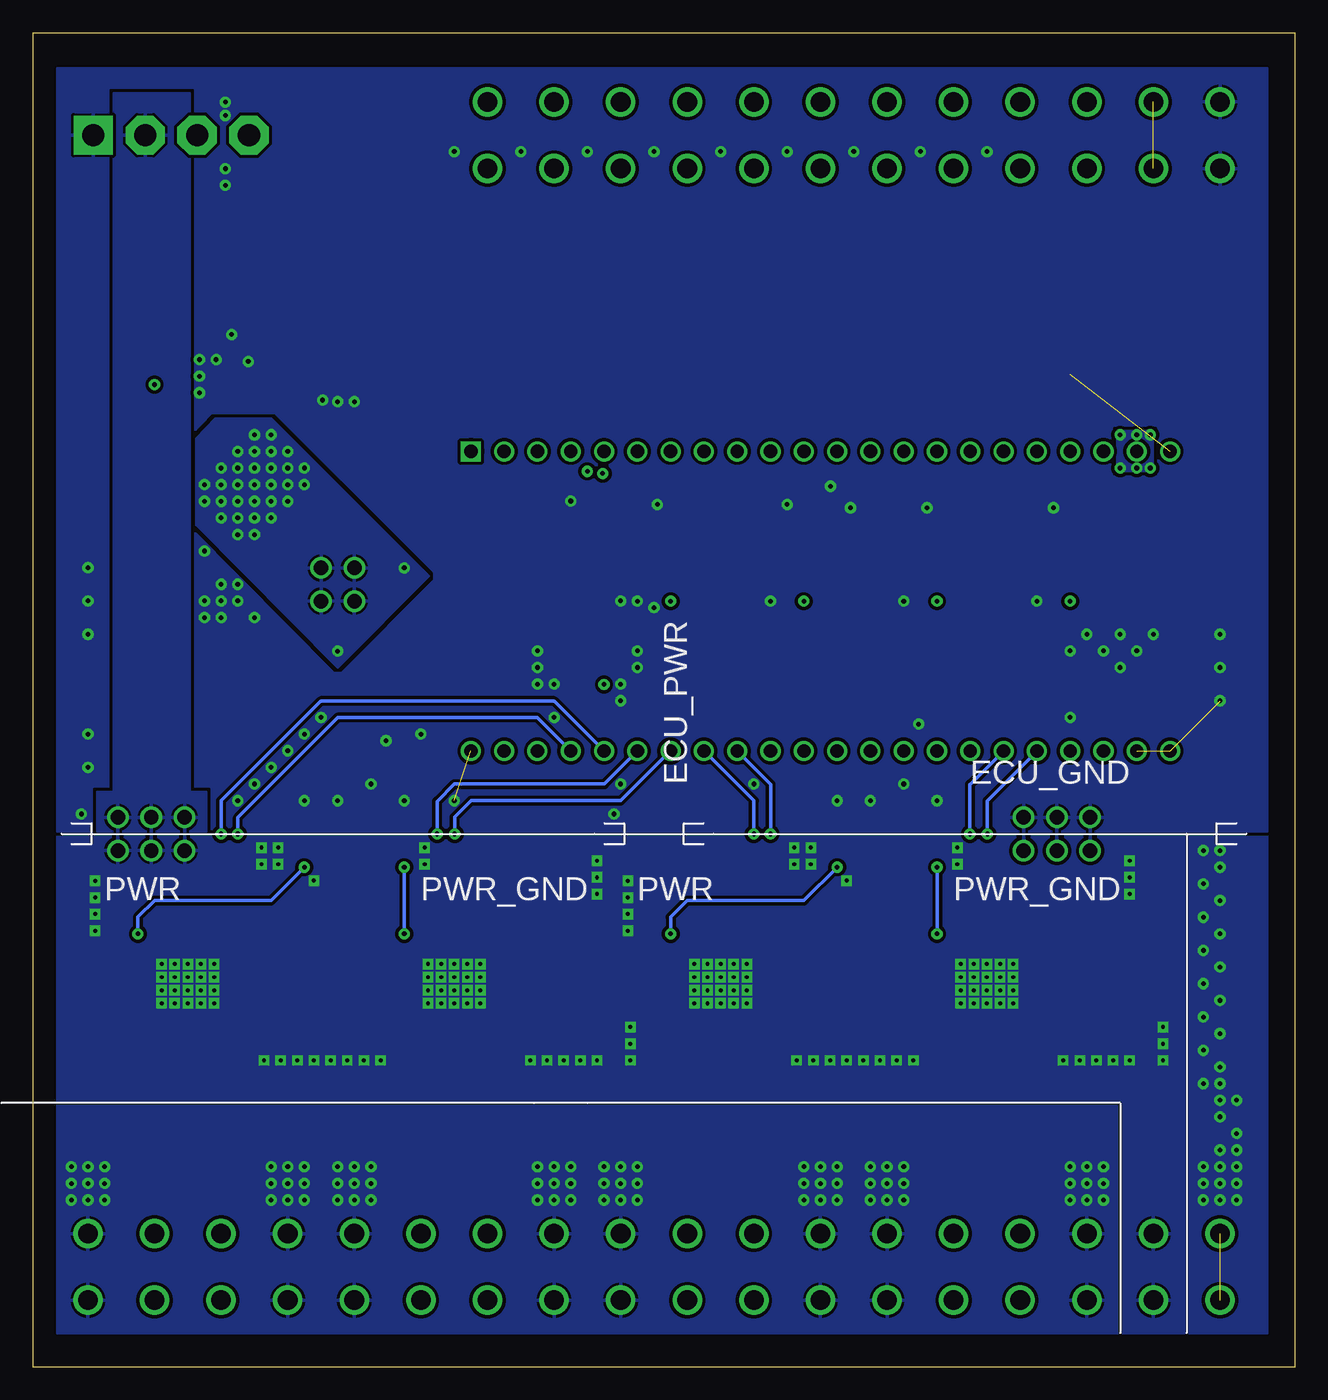
[diagram p14: board, bottom side, seen from below]

Size 96.3 x 101.8 mm. Coordinates in mm from the lower left corner, seen from the top.
Outline: 96.3,101.8 96.3,0 0,0 0,101.8 96.3,101.8
Copper layers (1+2*15+16): Top 0.07mm / dielectric 0.36mm / Route2 0.035mm / dielectric 0.71mm / Route15 0.035mm / dielectric 0.2mm / Bottom 0.07mm
Design rules "Multi-CB_4L_250µm-Tracks_OL105µm-IL35µm *": minimum track width 0.25mm, minimum drill 0.2mm, track to track 0.25mm, track to pad 0.25mm, pad to pad 0.2mm, via to via 0.25mm, smd to smd 0mil, copper to edge 0.2mm, drill to drill 0.2mm, minimum pad ring 0.25mm, minimum via ring 0.25mm, stop-mask expansion 2mil, vias tented up to drill 0.45mm, thermal gap 0.2mm
tKeepout: area 51.9,39.9 to 52.7,41.5; area 4.5,39.9 to 5.3,41.5; area 92.5,39.9 to 93.3,41.5; area 45.1,39.9 to 45.9,41.5
bKeepout: area 4.5,39.9 to 6,41.5; area 51.2,39.9 to 52.7,41.5; area 45.1,39.9 to 46.6,41.5; area 91.8,39.9 to 93.3,41.5

### Footprints (pad centres in the part's own frame; a part is rotated, then mirrored left to right if it is on the bottom)
WCAP-CSGP_0805_H0.8_R = smd 0.9 x 1.3: 1 -0.95,0; 2 0.95,0
WCAP-CSGP_1210_H2.5 = smd 0.9 x 2.5: 1 -1.55,0; 2 1.55,0
WCAP-CSGP_0805_H1.25_R = smd 0.9 x 1.3: 1 -0.95,0; 2 0.95,0
WCAP-ASLI_12.5X14(DXL) = smd 5.8 x 2.5: 1 5.05,0; 2 -5.05,0
WCAP-CSGP_1206_H0.8 = smd 0.9 x 1.6: 1 -1.55,0; 2 1.55,0
WE-TVSP_DO-214AB_BIDIRECTIONAL = smd 2.3 x 3.3: 1 -3.5,0; 2 3.5,0
WL-SMTW_3528 = smd 1.6 x 2.4: 1 -1.425,0; 2 1.425,0
SMC = smd 2.8 x 3.8: A 3.7,0; C -3.7,0
WE-TVS_SOT23-3L = smd 0.9 x 1.4: 1 -0.95,-1.05; 2 0.95,-1.05; 3 0,1.05
WE-TVS_SOT143-4L = smd 1.4 x 1.4: 1 -0.75,-1.1 | smd 1 x 1.4: 2 0.95,-1.1; 3 0.95,1.1; 4 -0.95,1.1
INF-PG-TO252-3-11_N = smd 1.75 x 0.95: 1 -3.55,2.28; 3 -3.55,-2.28 | smd 6.6 x 5.6: 2 3.55,0
638207222005 = drill 1.5: 1 -10.16,2.54; 2 -5.08,2.54; 3 0,2.54; 4 5.08,2.54; 5 10.16,2.54; A1 -10.16,-2.54; A2 -5.08,-2.54; A3 0,-2.54; A4 5.08,-2.54; A5 10.16,-2.54
61302211821 = drill 1.02: 1 -26.67,0; 2 -24.13,0; 3 -21.59,0; 4 -19.05,0; 5 -16.51,0; 6 -13.97,0; 7 -11.43,0; 8 -8.89,0; 9 -6.35,0; 10 -3.81,0; 11 -1.27,0; 12 1.27,0; 13 3.81,0; 14 6.35,0; 15 8.89,0; 16 11.43,0; 17 13.97,0; 18 16.51,0; 19 19.05,0; 20 21.59,0; 21 24.13,0; 22 26.67,0
61300421121 = drill 1.1: 1 -1.27,-1.27; 2 -1.27,1.27; 3 1.27,-1.27; 4 1.27,1.27
61300621121 = drill 1.1: 1 -2.54,-1.27; 2 -2.54,1.27; 3 0,-1.27; 4 0,1.27; 5 2.54,-1.27; 6 2.54,1.27
638207222007 = drill 1.5: 1 -15.24,2.54; 2 -10.16,2.54; 3 -5.08,2.54; 4 0,2.54; 5 5.08,2.54; 6 10.16,2.54; 7 15.24,2.54; A1 -15.24,-2.54; A2 -10.16,-2.54; A3 -5.08,-2.54; A4 0,-2.54; A5 5.08,-2.54; A6 10.16,-2.54; A7 15.24,-2.54
638207222008 = drill 1.5: 1 -17.78,2.54; 2 -12.7,2.54; 3 -7.62,2.54; 4 -2.54,2.54; 5 2.54,2.54; 6 7.62,2.54; 7 12.7,2.54; 8 17.78,2.54; A1 -17.78,-2.54; A2 -12.7,-2.54; A3 -7.62,-2.54; A4 -2.54,-2.54; A5 2.54,-2.54; A6 7.62,-2.54; A7 12.7,-2.54; A8 17.78,-2.54
R0805 = smd 1.3 x 1.5: 1 -0.95,0; 2 0.95,0
R1206 = smd 1.6 x 1.803: 1 -1.422,0; 2 1.422,0
XCVR_ESP32-S3-DEVKITC-1-N8R2 = drill 1.02 square: J1_1 -11.43,29.97 | drill 1.02: J1_2 -11.43,27.43; J1_3 -11.43,24.89; J1_4 -11.43,22.35; J1_5 -11.43,19.81; J1_6 -11.43,17.27; J1_7 -11.43,14.73; J1_8 -11.43,12.19; J1_9 -11.43,9.65; J1_10 -11.43,7.11; J1_11 -11.43,4.57; J1_12 -11.43,2.03; J1_13 -11.43,-0.51; J1_14 -11.43,-3.05; J1_15 -11.43,-5.59; J1_16 -11.43,-8.13; J1_17 -11.43,-10.67; J1_18 -11.43,-13.21; J1_19 -11.43,-15.75; J1_20 -11.43,-18.29; J1_21 -11.43,-20.83; J1_22 -11.43,-23.37; J3_1 11.43,29.97; J3_2 11.43,27.43; J3_3 11.43,24.89; J3_4 11.43,22.35; J3_5 11.43,19.81; J3_6 11.43,17.27; J3_7 11.43,14.73; J3_8 11.43,12.19; J3_9 11.43,9.65; J3_10 11.43,7.11; J3_11 11.43,4.57; J3_12 11.43,2.03; J3_13 11.43,-0.51; J3_14 11.43,-3.05; J3_15 11.43,-5.59; J3_16 11.43,-8.13; J3_17 11.43,-10.67; J3_18 11.43,-13.21; J3_19 11.43,-15.75; J3_20 11.43,-18.29; J3_21 11.43,-20.83; J3_22 11.43,-23.37
SOP65P600X115-15N-V = smd 1.31 x 0.45: 1 -2.85,1.95; 2 -2.85,1.3; 3 -2.85,0.65; 4 -2.85,0; 5 -2.85,-0.65; 6 -2.85,-1.3; 7 -2.85,-1.95; 8 2.85,-1.95; 9 2.85,-1.3; 10 2.85,-0.65; 11 2.85,0; 12 2.85,0.65; 13 2.85,1.3; 14 2.85,1.95 | smd 2.65 x 4: 15 0,0
SOIC127P602X173-8N-V = smd 1.47 x 0.65: 1 -2.765,1.905; 2 -2.765,0.635; 3 -2.765,-0.635; 4 -2.765,-1.905; 5 2.765,-1.905; 6 2.765,-0.635; 7 2.765,0.635; 8 2.765,1.905
B4P-VH = drill 1.7 pad 3 square: 1 -5.94,0 | drill 1.7 pad 3 octagon: 2 -1.98,0; 3 1.98,0; 4 5.94,0

### Placement (x,y rotation side)
C1  73.04,40.66 90 top
C2  29.86,40.66 90 top
C3  47.64,31.14 90 top
C4  38.75,21.61 0 top
C5  32.4,40.66 90 top
C6  27.32,31.14 90 top
C7  18.43,21.61 0 top
C8  28.59,21.61 0 top
C9  48.91,21.61 0 top
C10  90.12,67.89 180 top
C12  81.76,72.93 270 top
C13  67.96,31.14 90 top
C14  59.07,21.61 0 top
C15  79.83,78.76 270 top
C16  69.23,21.61 0 top
C17  53.99,64.79 0 top
C18  70.5,40.66 90 top
C19  53.99,53.98 0 top
C20  88.28,31.14 90 top
C21  79.39,21.61 0 top
C22  89.55,21.61 0 top
C23  85.74,50.8 180 top
C24  60.24,85.72 270 top
C25  57.9,85.72 270 top
C26  50.18,65.41 270 top
C27  47.64,65.41 270 top
C31  27.42,85.72 270 top
C32  17.16,65.41 270 top
C33  29.76,85.72 270 top
C34  19.7,65.41 270 top
C39  37.58,85.72 270 top
C40  27.32,65.41 270 top
C41  39.92,85.72 270 top
C42  32.4,65.41 270 top
C47  47.74,85.72 270 top
C48  37.48,65.41 270 top
C49  50.08,85.72 270 top
C50  40.02,65.41 270 top
D0  8.52,18.43 0 top
D1  19.06,17.8 0 top
D2  27.95,17.8 180 top
D3  39.38,17.8 0 top
D4  48.02,17.8 180 top
D5  89.3,85.75 180 top
D006  87.01,76.2 90 top
D7  68.59,17.8 180 top
D8  59.7,17.8 0 top
D9  88.66,17.8 180 top
D10  80.03,17.8 0 top
D11  81.51,87.68 0 top
D12  48.91,60.96 90 top
D13  18.43,60.96 90 top
D15  28.59,60.96 90 top
D17  38.75,60.96 90 top
G1  81.93,64.77 135 top
J1  81.93,7.62 180 top
J3  36.21,69.85 180 top
J4  73.04,59.69 0 top
J5  87.26,40.66 0 top
J6  36.21,46.99 180 top
J7  15.89,93.98 0 top
J8  46.37,93.98 0 top
J9  18.18,40.66 0 top
J13  15.89,7.62 180 top
J15  48.91,7.62 180 top
R1  81.49,82.53 90 top
R2  45.13,35.12 270 top
R3  78.95,82.53 90 top
R4  42.53,35.12 270 top
R5  65.45,35.12 270 top
R6  62.85,35.12 270 top
R7  34.94,40.66 270 top
R8  67.96,40.66 270 top
R9  85.77,35.12 270 top
R10  27.32,40.66 270 top
R11  83.17,35.12 270 top
R12  75.58,40.66 270 top
R13  22.21,35.12 270 top
R18  24.81,35.12 270 top
R21  24.55,85.72 90 top
R22  26.05,80.64 90 top
R23  17.16,74.3 270 top
R24  32.63,85.72 90 top
R25  31.13,80.64 90 top
R26  19.7,74.3 270 top
R27  63.11,85.72 90 top
R28  55.03,85.72 90 top
R29  61.61,80.64 90 top
R30  56.53,80.64 90 top
R31  50.18,74.3 270 top
R32  47.64,74.3 270 top
R39  34.71,85.72 90 top
R40  36.21,80.64 90 top
R41  27.32,74.3 270 top
R42  42.79,85.72 90 top
R43  41.29,80.64 90 top
R44  32.4,74.3 270 top
R51  44.87,85.72 90 top
R52  46.37,80.64 90 top
R53  37.48,74.3 270 top
R54  52.95,85.72 90 top
R55  51.45,80.64 90 top
R56  40.02,74.3 270 top
RX1  15.13,16.53 90 top
RX2  31.89,16.53 270 top
RX3  35.45,16.53 90 top
RX4  51.96,16.53 270 top
RX5  92.6,16.53 270 top
RX6  72.53,16.53 270 top
RX7  55.77,16.53 90 top
RX8  76.09,16.53 90 top
U1  32.91,58.42 270 top
U2  23.51,29.23 270 top
U3  43.83,29.23 270 top
U4  53.99,59.08 270 top
U5  64.15,29.23 270 top
U6  84.47,29.23 270 top
X2  85.74,93.98 180 top

### Tracks (layer width: path | path; a pad name or v marks a point on that pad's centre or on a via)
+3V3  (via drill 0.35)
  Top 1.016: D13.4 17.33,58.59 v17.16,58.42 | D15.4 27.49,58.59 v27.32,58.42 | D17.4 37.65,58.59 v37.48,58.42 | D12.4 47.81,58.59 v47.64,58.42 | U4.5 52.09,54.93 C19.1 53.04,52.39 v52.72,52.07
  pour Route15 (isolate 0.254, rank 2): 2.12,40.86 2.12,99.1 94.43,99.1 94.43,40.86
+5V  (via drill 0.35)
  Top 1.016: U4.3 53.35,64.47 C17.1 53.04,66.36 | v53.99,68.33 53.99,67.31 53.04,66.36 | v52.83,68.17 53.04,67.85 53.04,66.36
  Route15 1.016: U1.J1_21 13.51,68.33 v53.99,68.33 54.14,68.42 55.26,67.31 71.77,67.31 74.31,69.85 | v78.12,71.12 76.85,72.39 75.58,71.12 | 74.31,69.85 75.58,71.12 | v76.85,69.85 75.58,71.12 | v75.58,68.58 74.31,69.85
  other vias: 73.04,54.61 79.39,69.85 78.12,69.85 76.85,68.58 76.85,67.31 78.12,68.58 78.12,67.31 79.39,67.31 79.39,68.58 80.66,68.58 80.66,67.31 81.93,67.31 81.93,66.04 80.66,66.04 80.66,64.77 79.39,64.77 79.39,66.04 78.12,66.04 80.66,69.85 81.93,68.58 83.2,67.31 83.2,66.04 80.66,63.5 79.39,63.5 78.12,64.77 76.85,66.04 75.58,67.31 79.39,71.12 81.93,64.77 67.96,60.96 13.35,71.12 11.05,71.12 11.05,68.58 13.35,68.58 12.08,71.12 12.08,68.58
  pour Top: 83.84,70.86 82.4,72.39 78.12,72.39 66.06,60.33 73.04,53.34 83.84,64.23
  pour Route15 (isolate 0.254, no thermals): 10.81,71.39 13.6,71.39 13.6,68.35 10.81,68.35
  pour Top (isolate 0.254, no thermals): 10.81,71.39 13.6,71.39 13.6,68.35 10.81,68.35
  pour Bottom (isolate 0.254, no thermals): 10.81,71.39 13.6,71.39 13.6,68.35 10.81,68.35
  pour Bottom: 83.84,70.86 82.4,72.39 78.12,72.39 66.06,60.33 73.04,53.34 83.84,64.23
+6V
  pour Top (isolate 0.254, no thermals): 69.23,19.32 72.02,19.32 72.02,16.28 69.23,16.28
AGNDU2  (via drill 0.35)
  Top 0.254: U2.1 C6.2 v27.32,33.04 | R10.2 v27.32,38.12
  Bottom 0.254: v27.32,38.12 v27.32,33.04
AGNDU3  (via drill 0.35)
  Top 0.254: U3.1 C3.2 v47.64,33.04 | R7.2 v34.94,38.12
  Bottom 0.254: v34.94,38.12 37.48,35.58 46.37,35.58 47.64,34.31 v47.64,33.04
AGNDU4  (via drill 0.35)
  Top 0.254: U5.1 C13.2 v67.96,33.04 | R8.2 v67.96,38.12
  Bottom 0.254: v67.96,38.12 v67.96,33.04
AGNDU5  (via drill 0.35)
  Top 0.254: U6.1 C20.2 v88.28,33.04 | R12.2 v75.58,38.12
  Bottom 0.254: v75.58,38.12 78.12,35.58 87.01,35.58 88.28,34.31 v88.28,33.04
CAN1_RXD
  Top 0.254: U1.J1_5 52.72,69.39 51.89,68.56 51.89,67.85 52.16,67.59 52.16,61.91 U4.4
CAN1_TXD
  Top 0.254: U4.1 55.89,65.56 56.06,65.73 56.06,69.05 U1.J1_4
CAN_N
  Top 0.254: U4.6 53.35,57.55 53.74,57.94 53.74,58.63 55.3,60.19 60.84,60.19 73.73,73.08 73.85,72.97 74.52,72.97 74.98,73.44 74.98,74.1 74.87,74.22 76.85,76.2 76.85,77.47 | X2.4 79.39,93.57 79.39,87.79 D11.1 78.95,85.02 R3.2 77.78,83.48 76.85,82.55 76.85,77.47 | 76.85,77.47
CAN_P
  Top 0.254: U4.7 54.62,57.55 54.24,57.94 54.24,58.42 55.51,59.69 61.05,59.69 73.82,72.46 74.72,72.46 75.49,73.23 75.49,74.13 77.56,76.2 79.23,76.2 79.53,75.91 80.19,75.91 80.48,76.2 80.66,76.2 81.51,77.05 81.51,77.19 81.98,77.66 82.12,77.66 83.2,78.74 83.2,82.55 82.27,83.48 R1.2 82.46,84.45 D11.2 84.47,88.64 84.47,93.27 X2.3
CI1
  Top 0.508: D13.3 16.77,61.91 15.7,62.98 15.7,65.49 C32.1 U1.J1_19 R23.2 17.16,73.62 17.87,74.33 21.16,74.33 R22.1
CI2
  Top 0.508: R25.1 29.34,79.22 27.63,77.51 26.03,77.51 21.4,72.87 R26.2 U1.J1_18 C34.1 19.7,66.83 21.26,65.28 21.26,63.45 19.72,61.91 D13.2
CI3
  Top 0.508: D15.3 26.73,61.91 25.86,62.78 25.86,65.23 27.32,66.7 C40.1 U1.J1_15 R41.2 27.32,73.19 31.64,77.51 32.45,77.51 33.68,78.74 35.73,78.74 R40.1
CI4
  Top 0.508: D15.2 29.69,62.2 29.42,62.48 29.42,65.23 31.13,66.95 C42.1 U1.J1_13 R44.2 33.61,72.87 34.22,73.48 34.22,76.75 34.98,77.51 38.3,77.51 40.01,79.22 R43.1
CI5
  Top 0.508: D17.3 37.14,61.91 36.02,63.03 36.02,64.98 37.48,66.44 C48.1 U1.J1_11 R53.2 37.48,73.37 38.44,74.33 41.48,74.33 R52.1
CI6
  Top 0.508: R55.1 49.74,77.51 46.35,77.51 42.26,73.42 40.57,73.42 R56.2 U1.J1_10 C50.1 40.02,66.83 41.58,65.28 41.58,63.2 40.29,61.91 D17.2
CI7
  Top 0.508: D12.3 47.05,61.91 46.18,62.78 46.18,64.73 47.64,66.19 C27.1 U1.J1_7 R32.2 47.64,73.62 48.35,74.33 51.64,74.33 R30.1
CI8
  Top 0.508: R29.1 60.08,79.22 58.36,77.51 56.26,77.51 51.66,72.91 50.22,72.91 R31.2 U1.J1_6 C26.1 50.18,65.82 51.48,64.51 51.48,63.2 50.2,61.91 D12.2
ECU_GND  (via drill 0.35)  (4 unrouted)
  Top 1.016: D13.1 19.53,58.59 v19.7,58.42 | D15.1 29.69,58.59 v29.86,58.42 | D17.1 40.02,60.04 v40.02,58.42 | D12.1 50.18,60.04 v50.18,58.42 | U4.8 55.89,54.93 C19.2 54.94,53.68 v56.53,52.09 | C17.2 54.62,64.47 U4.2
  other vias: 73.04,73.64 71.77,73.64 28.72,49.04 74.18,73.77 48.91,57.93 51.45,58.44 17.16,54.63 15.89,55.9 10.81,55.9 12.08,54.63 13.35,53.36 17.16,49.55 50.18,53.36 51.45,52.09 5.73,55.9 5.73,53.36 5.73,50.82 51.45,50.82 51.96,42.18 83.58,74.31 34.94,43.2 32.4,43.2 29.86,44.47 27.32,43.2 13.35,55.9 14.62,54.63 69.36,47.77 66.69,48.28 57.8,53.36 57.8,54.63 50.18,54.63 92.09,60.98 92.09,58.44 87.01,74.95 92.09,55.9 92.09,48.28 92.09,45.74 92.6,42.18 75.58,43.2 73.04,43.2 70.5,44.47 67.96,43.2 57.8,52.09 38.75,65.81 35.45,67.18 33.92,65.55 28.08,65.55 18.43,65.55 48.66,65.81 55.26,66.06 79.86,76.71 81.13,78.78 81.61,91.43 81.61,90.16 81.61,95.49 81.61,96.51 83.58,75.58 83.58,76.86 82.31,76.86 80.66,58.44 79.39,57.17 81.93,57.17 83.2,57.17 83.2,62.25 80.66,59.71 83.2,58.44 81.93,58.44 81.93,59.71 28.59,92.73 33.67,92.73 38.75,92.73 43.83,92.73 48.91,92.73 53.99,92.73 59.07,92.73 64.15,92.73 23.51,92.73 75.58,48.28 76.85,47.01 78.12,45.74 79.39,44.47 51.45,44.47 64.15,43.2 41.29,44.47 56.53,49.55 74.31,49.55 80.66,43.2
  pour Top (isolate 0.254, rank 2): 2.12,40.86 2.12,99.1 94.43,99.1 94.43,40.86
  pour Bottom (isolate 0.254, rank 2): 2.12,40.86 2.12,99.1 94.43,99.1 94.43,40.86
  pour Route2 (isolate 0.254, rank 2): 2.12,40.86 2.12,99.1 94.43,99.1 94.43,40.86
ECU_PWR
  Top 1.27: J7.3 J7.A3
  pour Top (isolate 0.305): 84.33,78.08 84.33,97.19 90.12,97.19 90.12,78.08
  pour Bottom (isolate 0.254): 84.33,40.86 84.33,97.19 90.12,97.19 90.12,40.86
  pour Top (isolate 0.254): 83.06,40.86 83.06,43.85 91.39,43.85 91.39,40.86
  pour Bottom (isolate 0.254): 83.06,40.86 83.06,43.85 91.39,43.85 91.39,40.86
  pour Top (isolate 0.254): 90.12,93.84 2.12,93.84 2.12,99.1 90.12,99.1
I1
  Top 0.508: 26.05,87.63 R22.2 | R21.2 25.57,87.15 26.05,87.63 | C31.1 26.4,87.28 26.05,87.63 | 26.05,87.63 J7.A5 J7.5
I2
  Top 0.508: 31.13,87.63 R25.2 | C33.1 30.77,87.28 31.13,87.63 | R24.2 31.61,87.15 31.13,87.63 | 31.13,87.63 J8.A1 J8.1
I3
  Top 0.508: 36.21,87.63 R40.2 | R39.2 35.73,87.15 36.21,87.63 | C39.1 36.56,87.28 36.21,87.63 | 36.21,87.63 J8.A2 J8.2
I4
  Top 0.508: 41.29,87.63 R43.2 | C41.1 40.93,87.28 41.29,87.63 | R42.2 41.77,87.15 41.29,87.63 | 41.29,87.63 J8.A3 J8.3
I5
  Top 0.508: 46.37,87.63 R52.2 | R51.2 45.89,87.15 46.37,87.63 | C47.1 46.73,87.28 46.37,87.63 | 46.37,87.63 J8.A4 J8.4
I6
  Top 0.508: 51.45,87.63 R55.2 | C49.1 51.09,87.28 51.45,87.63 | R54.2 51.93,87.15 51.45,87.63 | 51.45,87.63 J8.A5 J8.5
I7
  Top 0.508: 56.53,87.63 J8.A6 J8.6 | 56.53,87.63 R30.2 | R28.2 56.05,87.15 56.53,87.63 | C25.1 56.88,87.28 56.53,87.63
I8
  Top 0.508: 61.61,87.63 J8.A7 J8.7 | 61.61,87.63 R29.2 | C24.1 61.25,87.28 61.61,87.63 | R27.2 62.09,87.15 61.61,87.63
N$1
  pour Top (isolate 0.254, no thermals): 48.91,19.32 51.7,19.32 51.7,16.28 48.91,16.28
N$2
  Top 0.254: R2.2 U3.2
N$3
  pour Top (isolate 0.254, no thermals): 90.12,74.33 90.12,53.91 84.47,48.26 76.85,48.26 76.85,53.34 81.93,53.34 84.33,55.74 84.33,74.33
N$4
  Top 0.254: R4.2 U3.6
N$5
  Top 0.254: R5.2 U5.2
N$6
  pour Top (isolate 0.254): 28.59,19.32 31.38,19.32 31.38,16.28 28.59,16.28
N$7
  Top 1.27: J7.4 J7.A4
N$8
  pour Top (isolate 0.254, no thermals): 15.64,19.32 18.43,19.32 18.43,16.28 15.64,16.28
N$9
  pour Top (isolate 0.254, no thermals): 35.96,19.32 38.75,19.32 38.75,16.28 35.96,16.28
N$10
  Top 0.254: R18.2 U2.2
N$11
  Top 0.254: R6.2 U5.6
N$12
  Top 0.254: R9.2 U6.2
N$13
  Top 0.254: R11.2 U6.6
N$14
  Top 0.254: R13.2 U2.6
N$15
  pour Top (isolate 0.254, no thermals): 89.55,19.32 92.34,19.32 92.34,16.28 89.55,16.28
N$16  (1 unrouted)
N$17
  Top 0.406: R3.1 79.83,80.7 | 79.83,80.7 C15.1 | R1.1 80.71,81.58 79.83,80.7
N$18
  pour Top (isolate 0.254, no thermals): 56.28,19.32 59.07,19.32 59.07,16.28 56.28,16.28
N$19
  pour Top (isolate 0.254, no thermals): 76.6,19.32 79.39,19.32 79.39,16.28 76.6,16.28
N$20  (1 unrouted)
PWR  (via drill 0.3)
  other vias: 23.51,28.73 23.51,29.73 23.51,30.73 23.51,27.73 24.51,27.73 25.51,27.73 22.51,27.73 21.51,27.73 21.51,28.73 21.51,29.73 21.51,30.73 22.51,30.73 22.51,29.73 22.51,28.73 24.51,28.73 24.51,29.73 24.51,30.73 25.51,30.73 25.51,29.73 25.51,28.73 43.83,29.73 43.83,30.73 43.83,28.73 43.83,27.73 44.83,27.73 44.83,28.73 44.83,29.73 44.83,30.73 45.83,30.73 45.83,29.73 45.83,28.73 45.83,27.73 42.83,27.73 42.83,28.73 42.83,29.73 42.83,30.73 41.83,30.73 41.83,29.73 41.83,28.73 41.83,27.73 29.13,23.38 30.4,23.38 31.67,23.38 32.94,23.38 34.21,23.38 35.48,23.38 36.75,23.38 38.02,23.38 17.7,23.38 16.43,23.38 15.16,23.38 13.89,23.38 12.62,23.38 10.08,23.38 10.08,24.65 10.08,25.92 12.62,38.62 12.62,37.35 12.62,36.08 34.21,37.1 50.91,37.08 50.91,35.81 50.91,34.54 50.91,33.27 36.94,39.62 38.21,39.62 38.21,38.35 36.94,38.35 25.76,38.35 25.76,39.62 64.15,28.73 64.15,29.73 64.15,30.73 64.15,27.73 65.15,27.73 66.15,27.73 63.15,27.73 62.15,27.73 62.15,28.73 62.15,29.73 62.15,30.73 63.15,30.73 63.15,29.73 63.15,28.73 65.15,28.73 65.15,29.73 65.15,30.73 66.15,30.73 66.15,29.73 66.15,28.73 84.47,29.73 84.47,30.73 84.47,28.73 84.47,27.73 85.47,27.73 85.47,28.73 85.47,29.73 85.47,30.73 86.47,30.73 86.47,29.73 86.47,28.73 86.47,27.73 83.47,27.73 83.47,28.73 83.47,29.73 83.47,30.73 82.47,30.73 82.47,29.73 82.47,28.73 82.47,27.73 69.77,23.38 71.04,23.38 72.31,23.38 73.58,23.38 74.85,23.38 76.12,23.38 77.39,23.38 78.66,23.38 58.34,23.38 57.07,23.38 55.8,23.38 54.53,23.38 53.26,23.38 50.72,23.38 50.72,24.65 50.72,25.92 53.26,38.62 53.26,37.35 53.26,36.08 74.85,37.1 91.55,37.08 91.55,35.81 91.55,34.54 91.55,33.27 77.58,39.62 78.85,39.62 78.85,38.35 77.58,38.35 66.4,38.35 66.4,39.62
  pour Top (isolate 0.254, rank 3): 8.47,20.34 8.47,40.46 94.43,40.46 94.43,20.34
  pour Top (isolate 0.254, rank 2): 8.52,2.54 8.52,23.26 13.15,23.26 13.15,2.54
  pour Bottom (isolate 0.254, rank 3): 8.47,20.34 8.47,40.46 94.43,40.46 94.43,20.34
  pour Bottom (isolate 0.254, rank 2): 8.47,2.54 8.47,23.26 13.15,23.26 13.15,2.54
PWR_GND  (via drill 0.35)
  other vias: 5.73,16.53 4.46,16.53 4.46,17.8 5.73,19.07 4.46,20.34 5.73,21.61 7,21.61 5.73,20.34 5.73,22.88 7,24.15 5.73,25.42 7,26.69 5.73,27.96 7,29.23 5.73,30.5 7,31.77 5.73,33.04 7,34.31 5.73,35.58 7,36.85 5.73,38.12 7,39.39 5.73,39.39 14.62,12.72 15.89,12.72 17.16,12.72 29.86,12.72 31.13,12.72 32.4,12.72 34.94,12.72 36.21,12.72 37.48,12.72 50.18,12.72 51.45,12.72 52.72,12.72 55.26,12.72 56.53,12.72 57.8,12.72 70.5,12.72 71.77,12.72 73.04,12.72 75.58,12.72 76.85,12.72 78.12,12.72 90.82,12.72 92.09,12.72 93.36,12.72 29.86,15.26 32.4,15.26 31.13,15.26 34.94,15.26 36.21,15.26 37.48,15.26 50.18,15.26 51.45,15.26 52.72,15.26 55.26,15.26 56.53,15.26 57.8,15.26 70.5,15.26 71.77,15.26 73.04,15.26 75.58,15.26 76.85,15.26 78.12,15.26 90.82,15.26 92.09,15.26 93.36,15.26 93.36,13.99 92.09,13.99 90.82,13.99 78.12,13.99 76.85,13.99 75.58,13.99 73.04,13.99 71.77,13.99 70.5,13.99 57.8,13.99 56.53,13.99 55.26,13.99 52.72,13.99 51.45,13.99 50.18,13.99 37.48,13.99 36.21,13.99 34.94,13.99 32.4,13.99 31.13,13.99 29.86,13.99 17.16,15.26 15.89,15.26 14.62,15.26 14.62,13.99 15.89,13.99 17.16,13.99 4.46,13.99 4.46,12.72 5.73,12.72 7,12.72 7,13.99 7,15.26 5.73,15.26 4.46,15.26 5.73,13.99
  pour Top (isolate 0.254, rank 2): 13.6,2.54 13.6,22.25 18.18,22.25 18.18,2.54
  pour Top (isolate 0.254, rank 2): 28.84,22.25 33.47,22.25 33.47,2.54 28.84,2.54
  pour Top (isolate 0.254, rank 2): 33.87,22.25 38.5,22.25 38.5,2.54 33.87,2.54
  pour Top (isolate 0.254, rank 2): 49.16,22.25 53.79,22.25 53.79,2.54 49.16,2.54
  pour Top (isolate 0.254, rank 2): 2.12,2.54 2.12,40.39 8.07,40.39 8.07,2.54
  pour Route2 (isolate 0.254, rank 4): 3.39,3.83 3.39,40.46 94.43,40.46 94.43,3.83
  pour Route15 (isolate 0.254, rank 4): 3.39,3.83 3.39,40.46 94.43,40.46 94.43,3.83
  pour Bottom (isolate 0.254, rank 4): 2.12,2.54 2.12,40.46 94.43,40.46 94.43,2.54
  pour Top (isolate 0.254, rank 2): 54.19,2.54 54.19,22.25 58.82,22.25 58.82,2.54
  pour Top (isolate 0.254, rank 2): 69.48,22.25 74.11,22.25 74.11,2.54 69.48,2.54
  pour Top (isolate 0.254, rank 2): 74.51,22.25 79.14,22.25 79.14,2.54 74.51,2.54
  pour Top (isolate 0.254, rank 2): 89.8,22.25 94.43,22.25 94.43,2.54 89.8,2.54
Q1
  pour Top (isolate 0.254, rank 2): 18.63,2.54 18.63,24.79 20.77,26.92 23.26,26.92 23.26,2.54
Q1C  (via drill 0.35)
  Top 0.254: v23.48,40.66 23.48,37.34 R13.1
  Bottom 0.254: v23.48,40.66 23.48,43.18 19.7,46.96 U1.J3_18
Q2
  pour Top (isolate 0.254, rank 2): 23.76,26.92 26.05,26.92 28.39,24.58 28.39,2.54 23.76,2.54
Q2C  (via drill 0.35)
  Top 0.254: R18.1 v24.81,40.66
  Bottom 0.254: v24.81,40.66 24.81,44.45 24.78,44.45 U1.J3_17
Q3
  pour Top (isolate 0.254, rank 2): 38.95,2.56 38.95,24.79 41.09,26.92 43.58,26.92 43.58,2.56
Q3C  (via drill 0.35)
  Top 0.254: R4.1 41.43,36.07 40.02,37.48 v40.02,40.66
  Bottom 0.254: v40.02,40.66 40.02,44.45 U1.J3_9
Q4
  pour Top (isolate 0.254, rank 2): 44.08,26.92 46.78,26.92 48.71,24.99 48.71,2.54 44.08,2.54
Q4C  (via drill 0.35)
  Top 0.254: R2.1 45.13,36.47 44.39,37.2 42.46,37.2 41.29,38.37 v41.29,40.66
  Bottom 0.254: v41.29,40.66 41.29,43.2 45.08,46.99 U1.J3_8
Q5
  pour Top (isolate 0.254, rank 2): 59.27,2.54 59.27,24.79 61.41,26.92 63.9,26.92 63.9,2.54
Q5C  (via drill 0.35)
  Top 0.254: v64.12,40.66 64.12,37.34 R6.1
  Bottom 0.254: v64.12,40.66 64.12,41.94 62.86,43.2 51.45,43.2 47.66,46.99 U1.J3_7
Q6
  pour Top (isolate 0.254, rank 2): 64.4,26.92 66.69,26.92 69.03,24.58 69.03,2.54 64.4,2.54
Q6C  (via drill 0.35)
  Top 0.254: R5.1 v65.45,40.66
  Bottom 0.254: v65.45,40.66 65.45,43.15 64.13,44.47 52.7,44.47 U1.J3_6
Q7
  pour Top (isolate 0.254, rank 2): 79.59,2.54 79.59,24.79 81.73,26.92 84.22,26.92 84.22,2.54
Q7C  (via drill 0.35)
  Top 0.254: R11.1 82.07,36.07 80.66,37.48 v80.66,40.66
  Bottom 0.254: v80.66,40.66 80.66,41.91 73.04,49.53 57.8,49.53 U1.J3_4
Q8
  pour Top (isolate 0.254, rank 2): 84.72,26.92 87.42,26.92 89.35,24.99 89.35,2.54 84.72,2.54
Q8C  (via drill 0.35)
  Top 0.254: R9.1 85.15,36.07 84.02,37.2 82.84,37.2 81.93,38.12 v81.93,40.66
  Bottom 0.254: v81.93,40.66 81.93,43.2 74.33,50.8 56.53,50.8 U1.J3_5

### Text on the board
tPlace: Breite: 101,8 mm, Länge: 96,3 mm | nutzbare Breite: 99 mm, Länge: 95 mm
tNames: L | H | P | M | +5V | ECU_GND | ECU_PWR | PWR | PWR | PWR_GND | PWR_GND | M | + | M | Q1 | Q2 | M | M | Q3 | Q4 | M | M | Q5 | Q6 | M | M | Q7 | Q8 | M | M | + | M | Q1 | Q2 | M | M | Q3 | Q4 | M | M | Q5 | Q6 | M | M | Q7 | Q8 | M
bNames: ECU_GND | ECU_PWR | PWR_GND | PWR | PWR_GND | PWR